# Altium project STM32H743XIH6 SOM Bd.PrjPcb (part 1 of 2)
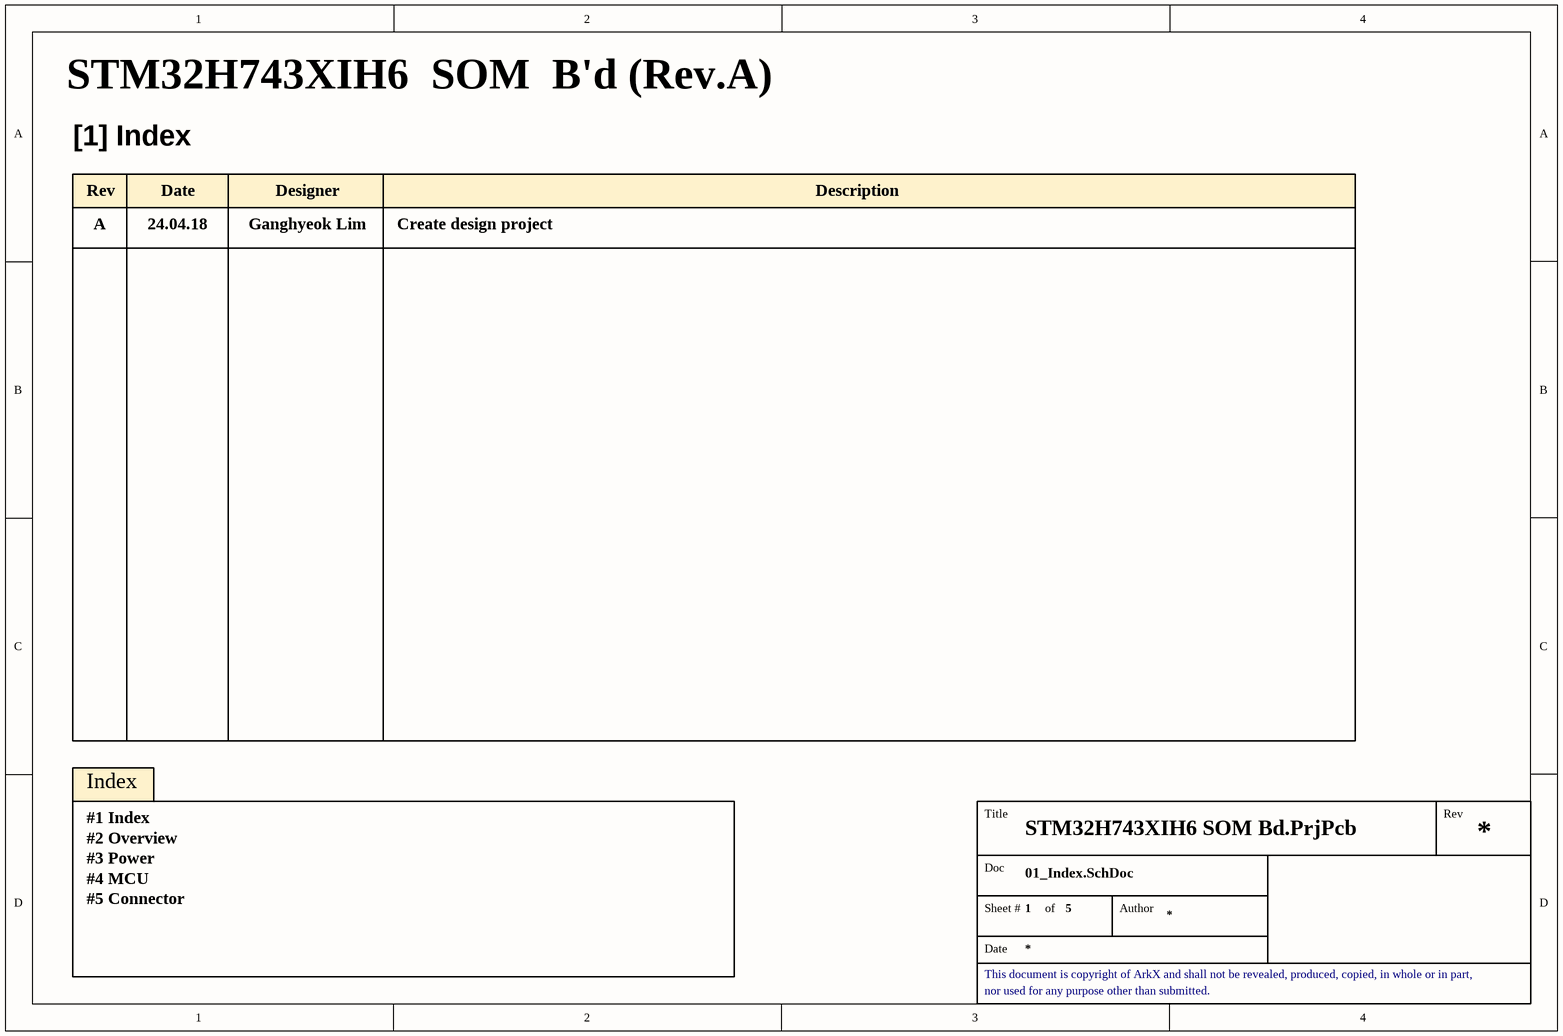
[diagram p0: 01_Index.SchDoc]
7 sheets, 147 parts. Net scope: flat (ports and power ports of the same name join across sheets).
Board file: STM32H743XIH6_SOM_Bd.PcbDoc
Sheets:
  01_Index.SchDoc
  02_Overview.SchDoc
  03_Power.SchDoc
  04_MCU-Part1.SchDoc
  05_MCU-Part2.SchDoc
  06_MCU_Part3.SchDoc
  07_Connector.SchDoc

## Sheet 01_Index.SchDoc
size A4; SheetNumber: 1; SheetTotal: 5

### Notes on the sheet
- STM32H743XIH6  SOM  B'd (Rev.A)
- [1] Index
- Rev
- A
- 24.04.18
- Date
- Ganghyeok Lim
- Designer
- Create design project
- Description
- Index
- #1 Index
- #2 Overview
- #3 Power
- #4 MCU
- #5 Connector
- Title
- Doc
- Sheet #
- of
- Author
- This document is copyright of ArkX and shall not be revealed, produced, copied, in whole or in part,
- nor used for any purpose other than submitted.

## Sheet 02_Overview.SchDoc
size A4; SheetNumber: 2; SheetTotal: 5
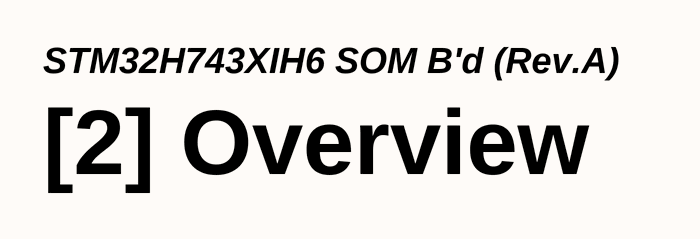
[diagram p1: 02_Overview.SchDoc]

### Notes on the sheet
- STM32H743XIH6 SOM B'd (Rev.A)
- [2] Overview
- Title
- Rev
- Doc
- Sheet #
- of
- Author
- This document is copyright of ArkX and shall not be revealed, produced, copied, in whole or in part,
- Date
- nor used for any purpose other than submitted.

## Sheet 03_Power.SchDoc
size A4; SheetNumber: 3; SheetTotal: 7
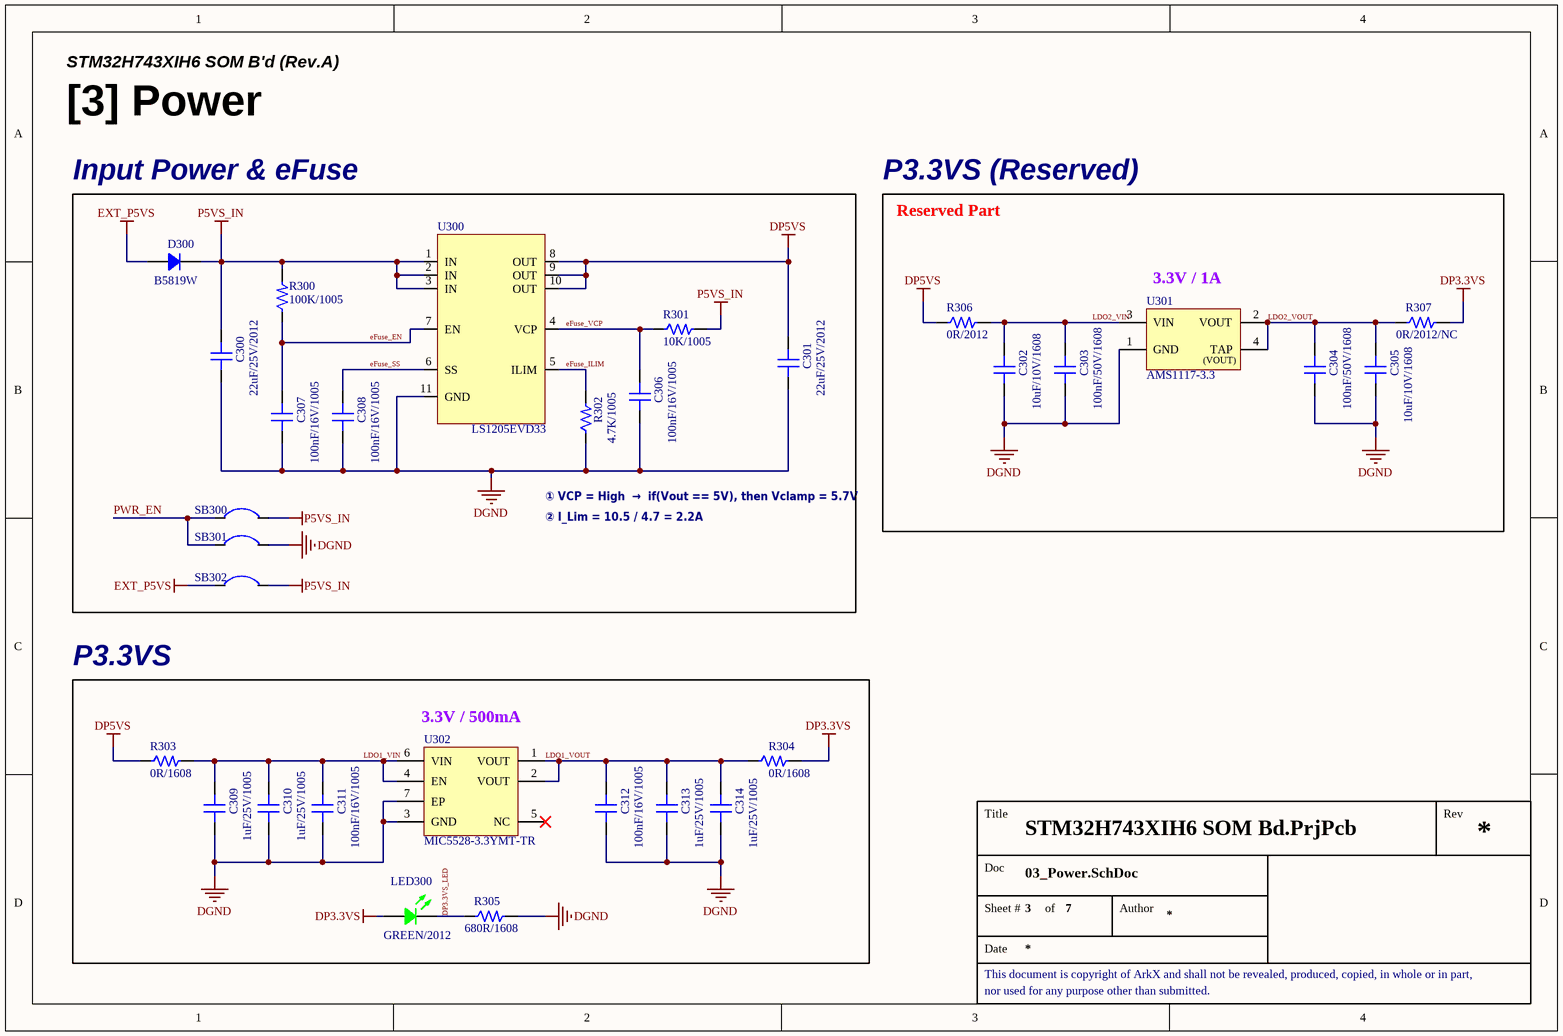
[diagram p2: 03_Power.SchDoc]

### Parts
C300  22uF/25V/2012  [CAP 2012 (0805_INCH)]
C301  22uF/25V/2012  [CAP 2012 (0805_INCH)]
C302  10uF/10V/1608  [CAP 1608 (0603_INCH)]
C303  100nF/50V/1608  [CAP 1608 (0603_INCH)]
C304  100nF/50V/1608  [CAP 1608 (0603_INCH)]
C305  10uF/10V/1608  [CAP 1608 (0603_INCH)]
C306  100nF/16V/1005  [CAP 1005 (0402_INCH)]
C307  100nF/16V/1005  [CAP 1005 (0402_INCH)]
C308  100nF/16V/1005  [CAP 1005 (0402_INCH)]
C309  1uF/25V/1005  [CAP 1005 (0402_INCH)]
C310  1uF/25V/1005  [CAP 1005 (0402_INCH)]
C311  100nF/16V/1005  [CAP 1005 (0402_INCH)]
C312  100nF/16V/1005  [CAP 1005 (0402_INCH)]
C313  1uF/25V/1005  [CAP 1005 (0402_INCH)]
C314  1uF/25V/1005  [CAP 1005 (0402_INCH)]
D300  B5819W  [DIO_SOD-123]
LED300  GREEN/2012  [LED MHT170RGBCT (GREEN)]
R300  100K/1005  [RES 1005 (0402_inch)]
R301  10K/1005  [RES 1005 (0402_inch)]
R302  4.7K/1005  [RES 1005 (0402_inch)]
R303  0R/1608  [RES 1608 (0603_inch)]
R304  0R/1608  [RES 1608 (0603_inch)]
R305  680R/1608  [RES 1608 (0603_inch)]
R306  0R/2012  [RES 2012 (0805_inch)]
R307  0R/2012/NC  [RES 2012 (0805_INCH)/NC]
SB300  SB  [SB (Solder-Bridge)]  (value not drawn)
SB301  SB  [SB (Solder-Bridge)]  (value not drawn)
SB302  SB  [SB (Solder-Bridge)]  (value not drawn)
U300  LS1205EVD33  [IC_DFN_3x3_10L]
U301  AMS1117-3.3  [SOT 223-3 (DIODES INCORPORATED)]
U302  MIC5528-3.3YMT-TR  [IC_TDFN-6]

### Blocks framed on the sheet
Input Power & eFuse: C300 C301 C306-C308 D300 R300-R302 SB300-SB302 U300
P3.3VS (Reserved): C302-C305 R306 R307 U301
P3.3VS: C309-C314 LED300 R303-R305 U302

### Nets
DGND: C300.1 C301.1 C302.1 C303.1 C304.1 C305.1 C306.1 C307.1 C308.1 C309.1 C310.1 C311.1 C312.1 C313.1 C314.1 R302.1 R305.2 SB301.2 U300.11(GND) U301.1(GND) U302.3(GND) U302.7(EP)
DP3.3VS: LED300.4(Common_Anode) R304.2 R307.2
DP5VS: C301.2 R303.1 R306.1 U300.8(OUT) U300.9(OUT) U300.10(OUT)
EXT_P5VS: D300.1 SB302.1
P5VS_IN: C300.2 D300.2 R300.2 R301.2 SB300.2 SB302.2 U300.1(IN) U300.2(IN) U300.3(IN)
DP3.3VS_LED: LED300.2(GREEN) R305.1
eFuse_EN: C307.2 R300.1 U300.7(EN)
eFuse_ILIM: R302.2 U300.5(ILIM)
eFuse_SS: C308.2 U300.6(SS)
eFuse_VCP: C306.2 R301.1 U300.4(VCP)
LDO1_VIN: C309.2 C310.2 C311.2 R303.2 U302.4(EN) U302.6(VIN)
LDO1_VOUT: C312.2 C313.2 C314.2 R304.1 U302.1(VOUT) U302.2(VOUT)
LDO2_VIN: C302.2 C303.2 R306.2 U301.3(VIN)
LDO2_VOUT: C304.2 C305.2 R307.1 U301.2(VOUT) U301.4(TAP)
PWR_EN: SB300.1 SB301.1

Not connected (* = marked no-connect by the designer): U302 5(NC)*

### Notes on the sheet
- STM32H743XIH6 SOM B'd (Rev.A)
- [3] Power
- Reserved Part
- (near U301) 3.3V / 1A
- ① VCP = High  →  if(Vout == 5V), then Vclamp = 5.7V
- ② I_Lim = 10.5 / 4.7 = 2.2A
- (near U302) 3.3V / 500mA
- Title
- Rev
- Doc
- Sheet #
- of
- Author
- This document is copyright of ArkX and shall not be revealed, produced, copied, in whole or in part,
- Date
- nor used for any purpose other than submitted.
- (in symbol IC_REG_AMS1117-3.3) (VOUT)

### Library data of the parts
C300 C301 = CAP_22uF/25V/2012: Ceramic CAP_22uF/25V/2012; LCSC Part #: C45783; JLCPCB Part Type: Basic Part
C302 C305 = CAP_10uF/10V/1608: Ceramic CAP_10uF/10V/1608; LCSC Part #: C19702; JLCPCB Part Type: Basic Part
C303 C304 = CAP_100nF/50V/1608: Ceramic CAP_100nF/50V/1608; LCSC Part #: C14663; JLCPCB Part Type: Basic Part
C306-C308 C311 C312 = CAP_100nF/16V/1005: Ceramic CAP_100nF/16V/1005; LCSC Part #: C1525; JLCPCB Part Type: Basic Part
C309 C310 C313 C314 = CAP_1uF/25V/1005: Ceramic CAP_1uF/25V/1005; LCSC Part #: C52923; JLCPCB Part Type: Basic Part
D300 = DIO_B5819W: 40V 600mV@1A 1A SOD-123  Schottky Barrier Diodes (SBD) ROHS; LCSC Part #: C8598; JLCPCB Part Type: Basic Part
LED300 = LED_MHT170RGBCT(GREEN): Colorless transparence -30℃~+85℃ Positive post Common anode RGB 120° 0805  Light Emitting Diodes (LED) ROHS; LCSC Part #: C2962094; JLCPCB Part Type: Extended Part
R300 = RES_100K/1005/62.5mW: Value: 100K; Power Rating: 62.5mW; Precision: 1%; Size: 1005; LCSC Part #: C25741; JLCPCB Part Type: Basic Part
R301 = RES_10K/1005/62.5mW: Value: 10K; Power Rating: 62.5mW; Precision: 1%; Size: 1005; LCSC Part #: C25744; JLCPCB Part Type: Basic Part
R302 = RES_4.7K/1005/62.5mW: Value: 4.7K; Power Rating: 62.5mW; Precision: 1%; Size: 1005; LCSC Part #: C25900; JLCPCB Part Type: Basic Part
R303 R304 = RES_0R/1608/0.1W: Value: 0R; Power Rating: 0.1W; Precision: 1%; Size: 1608; LCSC Part #: C21189; JLCPCB Part Type: Basic Part
R305 = RES_680R/1608/0.1W: Value: 680R; Power Rating: 0.1W; Precision: 1%; Size: 1608; LCSC Part #: C23228; JLCPCB Part Type: Basic Part
R306 = RES_0R/2012/0.125W: Value: 0R; Power Rating: 0.125W; Precision: 1%; Size: 2012; LCSC Part #: C17477; JLCPCB Part Type: Basic Part
R307 = RES_NC_0R/2012/0.125W: 0R/2012/0.125W/NC; Value: 0R; Power Rating: 0.1W; Precision: 1%; Size: 1608
SB300-SB302 = SB_Solder-Bridge
U300 = IC_eFUSE_LS1205EVD33: 18V, 5A eFuse with Programmable Current Limit and Output Voltage Clamp, 10-DFN (3x3)
U301 = IC_REG_AMS1117-3.3: 72dB@(120Hz) 1A 1.3V@(800mA) Fixed 3.3V~3.3V Positive 1 SOT-223  Linear Voltage Regulators (LDO) ROHS; LCSC Part #: C6186; JLCPCB Part Type: Basic Part
U302 = IC_REG_MIC5528-3.3YMT-TR: Linear Voltage Regulator IC Positive Fixed 1 Output 500mA 6-TDFN (1.2x1.2); LCSC Part #: C622490; JLCPCB Part Type: Extended Part

## Sheet 04_MCU-Part1.SchDoc
size A3; SheetNumber: 4; SheetTotal: 7
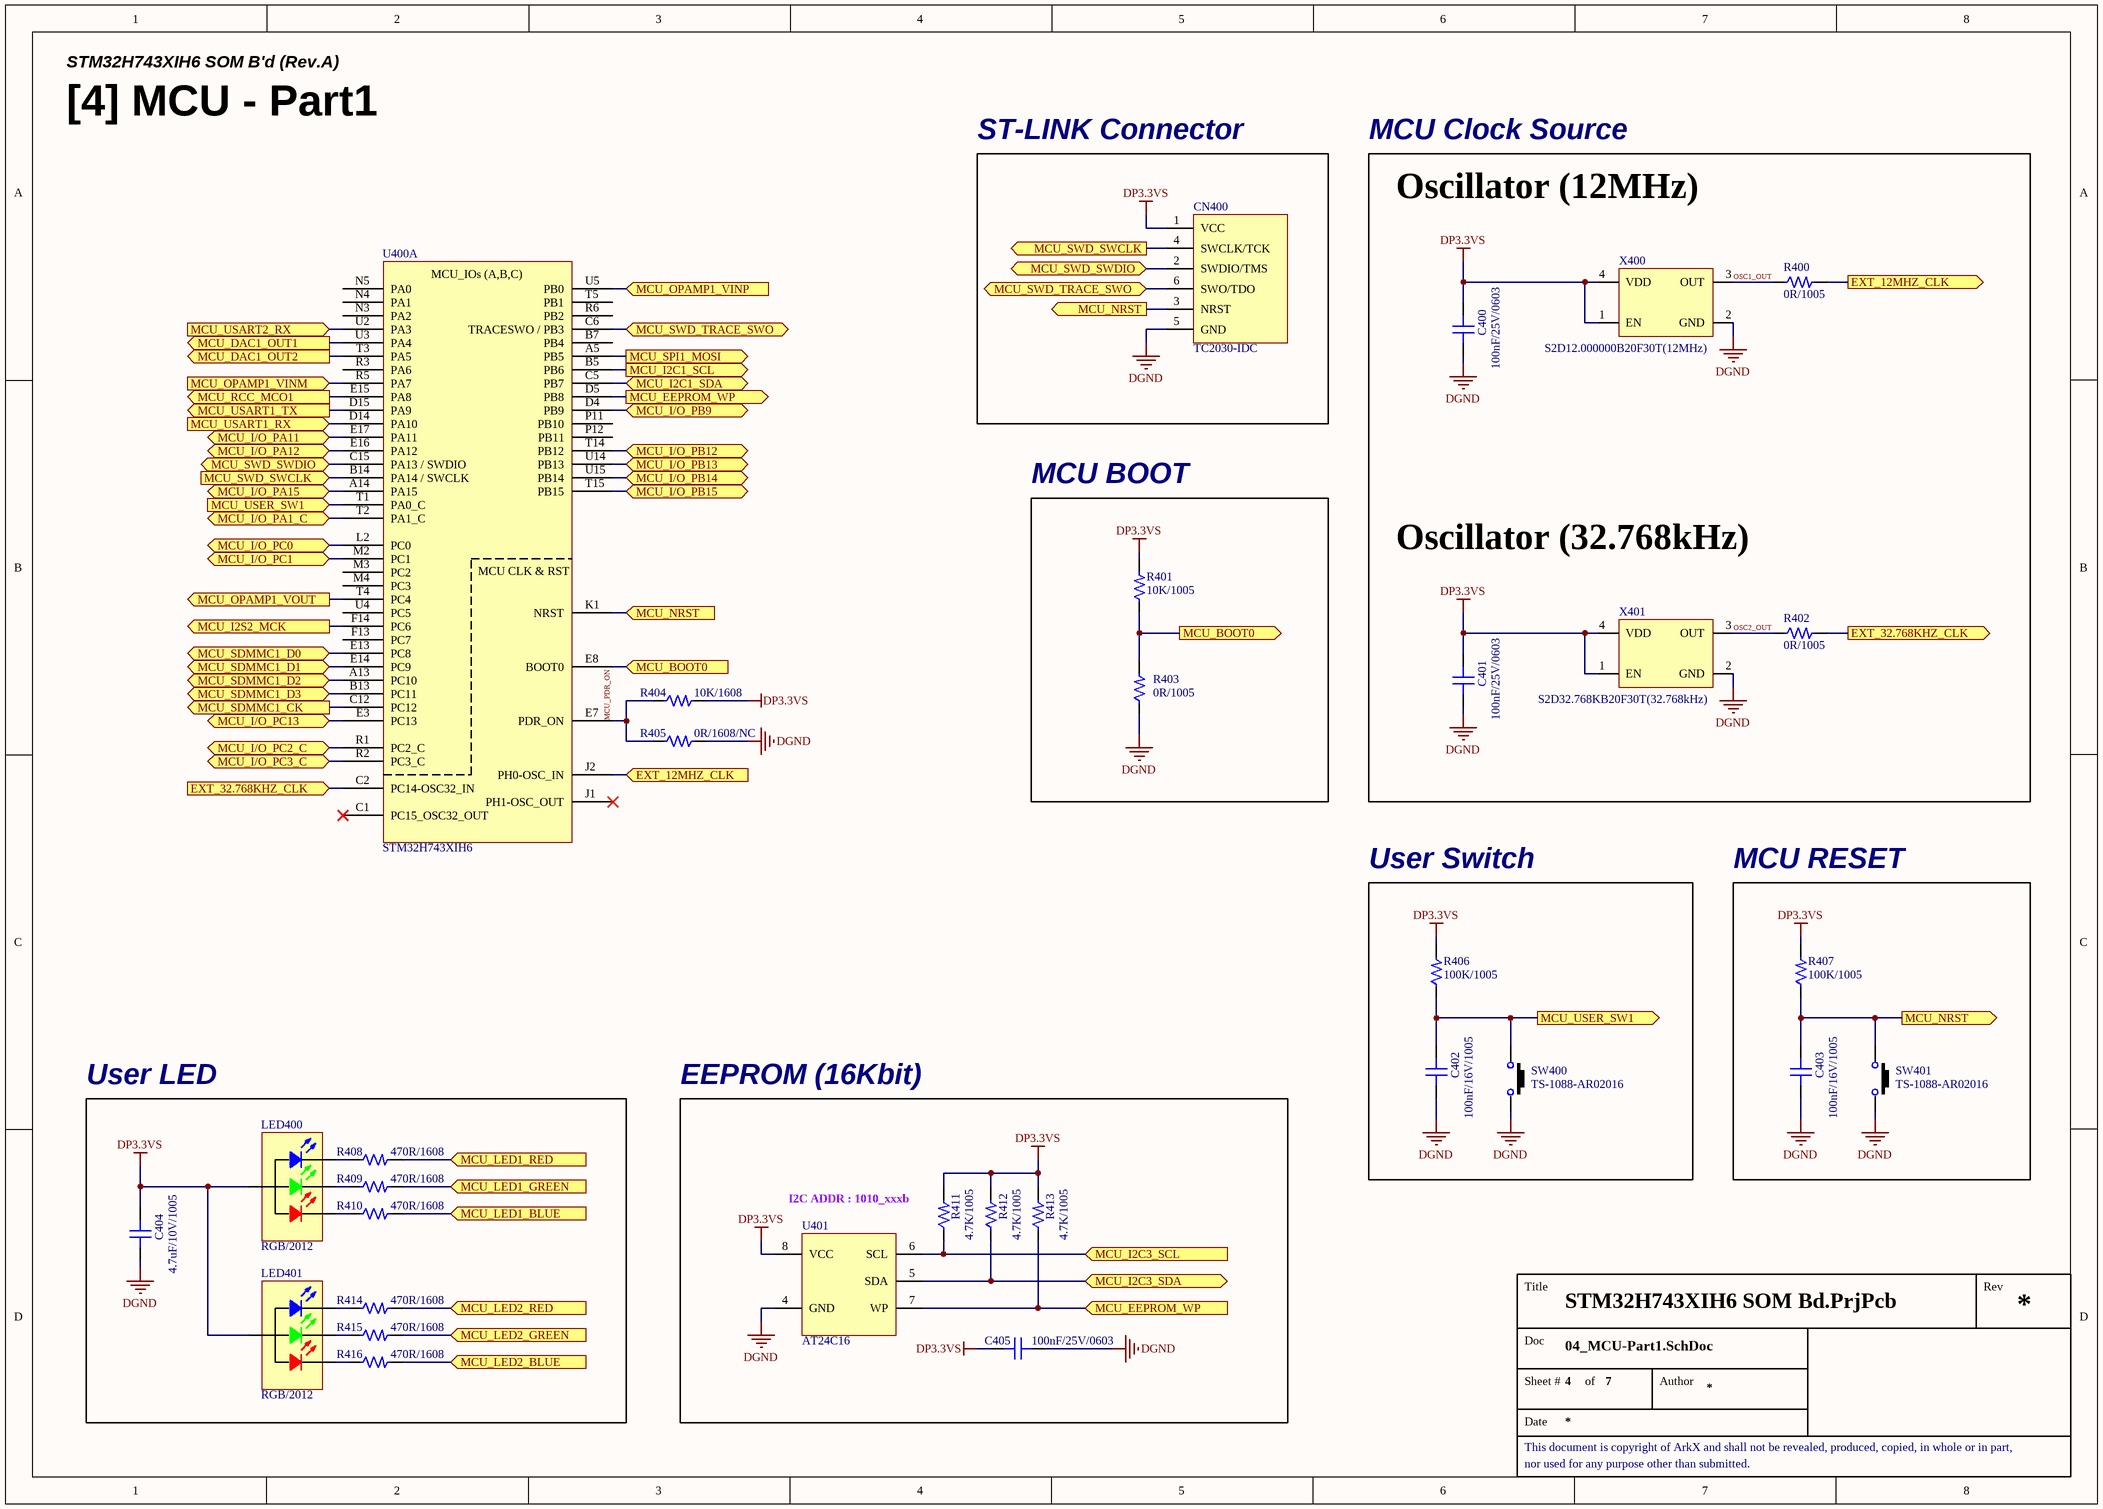
[diagram p3: 04_MCU-Part1.SchDoc]

### Parts
C400  100nF/25V/0603  [CAP 0603 (0201_INCH)]
C401  100nF/25V/0603  [CAP 0603 (0201_INCH)]
C402  100nF/16V/1005  [CAP 1005 (0402_INCH)]
C403  100nF/16V/1005  [CAP 1005 (0402_INCH)]
C404  4.7uF/10V/1005  [CAP 1005 (0402_INCH)]
C405  100nF/25V/0603  [CAP 0603 (0201_INCH)]
CN400  TC2030-IDC  [CON_TC2030-FP]  (no BOM)
LED400  RGB/2012  [LED MHT170RGBCT]
LED401  RGB/2012  [LED MHT170RGBCT]
R400  0R/1005  [RES 1005 (0402_inch)]
R401  10K/1005  [RES 1005 (0402_inch)]
R402  0R/1005  [RES 1005 (0402_inch)]
R403  0R/1005  [RES 1005 (0402_inch)]
R404  10K/1608  [RES 1608 (0603_inch)]
R405  0R/1608/NC  [RES 1608 (0603_inch)/NC]
R406  100K/1005  [RES 1005 (0402_inch)]
R407  100K/1005  [RES 1005 (0402_inch)]
R408  470R/1608  [RES 1608 (0603_inch)]
R409  470R/1608  [RES 1608 (0603_inch)]
R410  470R/1608  [RES 1608 (0603_inch)]
R411  4.7K/1005  [RES 1005 (0402_inch)]
R412  4.7K/1005  [RES 1005 (0402_inch)]
R413  4.7K/1005  [RES 1005 (0402_inch)]
R414  470R/1608  [RES 1608 (0603_inch)]
R415  470R/1608  [RES 1608 (0603_inch)]
R416  470R/1608  [RES 1608 (0603_inch)]
SW400  TS-1088-AR02016  [SW_TS-1088-AR02016]
SW401  TS-1088-AR02016  [SW_TS-1088-AR02016]
U400  STM32H743XIH6  [IC TFBGA-265]  (part A of 4)
U401  AT24C16  [TSSOP-8_PW (TI)]
X400  S2D12.000000B20F30T(12MHz)  [OSC SMD_2.5x2.0 (SCTF)]
X401  S2D32.768KB20F30T(32.768kHz)  [OSC SMD_2.5x2.0 (SCTF)]

### Blocks framed on the sheet
ST-LINK Connector: CN400
MCU BOOT: R401 R403
User Switch: C402 R406 SW400
MCU RESET: C403 R407 SW401
User LED: C404 LED400 LED401 R408-R410 R414-R416
EEPROM (16Kbit): C405 R411-R413 U401

### Ports
EXT_12MHZ_CLK (in), EXT_12MHZ_CLK (out), EXT_32.768KHZ_CLK (in), EXT_32.768KHZ_CLK (out), MCU_BOOT0 (in), MCU_BOOT0 (out), MCU_DAC1_OUT1 (out), MCU_DAC1_OUT2 (out), MCU_EEPROM_WP (in), MCU_EEPROM_WP (out), MCU_I2C1_SCL (out), MCU_I2C1_SDA (bidir), MCU_I2C3_SCL (in), MCU_I2C3_SDA (bidir), MCU_I2S2_MCK (out), MCU_I/O_PA1_C (bidir), MCU_I/O_PA11 (bidir), MCU_I/O_PA12 (bidir), MCU_I/O_PA15 (bidir), MCU_I/O_PB9 (bidir), MCU_I/O_PB12 (bidir), MCU_I/O_PB13 (bidir), MCU_I/O_PB14 (bidir), MCU_I/O_PB15 (bidir), MCU_I/O_PC0 (bidir), MCU_I/O_PC1 (bidir), MCU_I/O_PC2_C (bidir), MCU_I/O_PC3_C (bidir), MCU_I/O_PC13 (bidir), MCU_LED1_BLUE (in), MCU_LED1_GREEN (in), MCU_LED1_RED (in), MCU_LED2_BLUE (in), MCU_LED2_GREEN (in), MCU_LED2_RED (in), MCU_NRST (in), MCU_NRST (out), MCU_OPAMP1_VINM (in), MCU_OPAMP1_VINP (in), MCU_OPAMP1_VOUT (out), MCU_RCC_MCO1 (out), MCU_SDMMC1_CK (out), MCU_SDMMC1_D0 (bidir), MCU_SDMMC1_D1 (bidir), MCU_SDMMC1_D2 (bidir), MCU_SDMMC1_D3 (bidir), MCU_SPI1_MOSI (out), MCU_SWD_SWCLK (in), MCU_SWD_SWCLK (out), MCU_SWD_SWDIO (bidir), MCU_SWD_TRACE_SWO (bidir), MCU_USART1_RX (in), MCU_USART1_TX (out), MCU_USART2_RX (in), MCU_USER_SW1 (in), MCU_USER_SW1 (out)

### Nets
DGND: C400.2 C401.2 C402.1 C403.1 C404.1 C405.2 CN400.5(GND) R403.1 R405.2 SW400.2 SW401.2 U401.4(GND) X400.2(GND) X401.2(GND)
DP3.3VS: C400.1 C401.1 C404.2 C405.1 CN400.1(VCC) LED400.4(Common_Anode) LED401.4(Common_Anode) R401.2 R404.2 R406.2 R407.2 R411.2 R412.2 R413.2 U401.8(VCC) X400.1(EN) X400.4(VDD) X401.1(EN) X401.4(VDD)
EXT_12MHZ_CLK: R400.2 U400.J2(PH0-OSC_IN) ; port EXT_12MHZ_CLK
EXT_32.768KHZ_CLK: R402.2 U400.C2(PC14-OSC32_IN) ; port EXT_32.768KHZ_CLK
MCU_BOOT0: R401.1 R403.2 U400.E8(BOOT0) ; port MCU_BOOT0
MCU_DAC1_OUT1: U400.U3(PA4) ; port MCU_DAC1_OUT1
MCU_DAC1_OUT2: U400.T3(PA5) ; port MCU_DAC1_OUT2
MCU_EEPROM_WP: R413.1 U400.D5(PB8) U401.7(WP) ; port MCU_EEPROM_WP
MCU_I2C1_SCL: U400.B5(PB6) ; port MCU_I2C1_SCL
MCU_I2C1_SDA: U400.C5(PB7) ; port MCU_I2C1_SDA
MCU_I2C3_SCL: R411.1 U401.6(SCL) ; port MCU_I2C3_SCL
MCU_I2C3_SDA: R412.1 U401.5(SDA) ; port MCU_I2C3_SDA
MCU_I2S2_MCK: U400.F14(PC6) ; port MCU_I2S2_MCK
MCU_I/O_PA1_C: U400.T2(PA1_C) ; port MCU_I/O_PA1_C
MCU_I/O_PA11: U400.E17(PA11) ; port MCU_I/O_PA11
MCU_I/O_PA12: U400.E16(PA12) ; port MCU_I/O_PA12
MCU_I/O_PA15: U400.A14(PA15) ; port MCU_I/O_PA15
MCU_I/O_PB9: U400.D4(PB9) ; port MCU_I/O_PB9
MCU_I/O_PB12: U400.T14(PB12) ; port MCU_I/O_PB12
MCU_I/O_PB13: U400.U14(PB13) ; port MCU_I/O_PB13
MCU_I/O_PB14: U400.U15(PB14) ; port MCU_I/O_PB14
MCU_I/O_PB15: U400.T15(PB15) ; port MCU_I/O_PB15
MCU_I/O_PC0: U400.L2(PC0) ; port MCU_I/O_PC0
MCU_I/O_PC1: U400.M2(PC1) ; port MCU_I/O_PC1
MCU_I/O_PC2_C: U400.R1(PC2_C) ; port MCU_I/O_PC2_C
MCU_I/O_PC3_C: U400.R2(PC3_C) ; port MCU_I/O_PC3_C
MCU_I/O_PC13: U400.E3(PC13) ; port MCU_I/O_PC13
MCU_LED1_BLUE: R410.2 ; port MCU_LED1_BLUE
MCU_LED1_GREEN: R409.2 ; port MCU_LED1_GREEN
MCU_LED1_RED: R408.2 ; port MCU_LED1_RED
MCU_LED2_BLUE: R416.2 ; port MCU_LED2_BLUE
MCU_LED2_GREEN: R415.2 ; port MCU_LED2_GREEN
MCU_LED2_RED: R414.2 ; port MCU_LED2_RED
MCU_NRST: C403.2 CN400.3(NRST) R407.1 SW401.1 U400.K1(NRST) ; port MCU_NRST
MCU_OPAMP1_VINM: U400.R5(PA7) ; port MCU_OPAMP1_VINM
MCU_OPAMP1_VINP: U400.U5(PB0) ; port MCU_OPAMP1_VINP
MCU_OPAMP1_VOUT: U400.T4(PC4) ; port MCU_OPAMP1_VOUT
MCU_PDR_ON: R404.1 R405.1 U400.E7(PDR_ON)
MCU_RCC_MCO1: U400.E15(PA8) ; port MCU_RCC_MCO1
MCU_SDMMC1_CK: U400.C12(PC12) ; port MCU_SDMMC1_CK
MCU_SDMMC1_D0: U400.E13(PC8) ; port MCU_SDMMC1_D0
MCU_SDMMC1_D1: U400.E14(PC9) ; port MCU_SDMMC1_D1
MCU_SDMMC1_D2: U400.A13(PC10) ; port MCU_SDMMC1_D2
MCU_SDMMC1_D3: U400.B13(PC11) ; port MCU_SDMMC1_D3
MCU_SPI1_MOSI: U400.A5(PB5) ; port MCU_SPI1_MOSI
MCU_SWD_SWCLK: CN400.4(SWCLK/TCK) U400.B14(PA14_/_SWCLK) ; port MCU_SWD_SWCLK
MCU_SWD_SWDIO: CN400.2(SWDIO/TMS) U400.C15(PA13_/_SWDIO) ; port MCU_SWD_SWDIO
MCU_SWD_TRACE_SWO: CN400.6(SWO/TDO) U400.C6(TRACESWO_/_PB3) ; port MCU_SWD_TRACE_SWO
MCU_USART1_RX: U400.D14(PA10) ; port MCU_USART1_RX
MCU_USART1_TX: U400.D15(PA9) ; port MCU_USART1_TX
MCU_USART2_RX: U400.U2(PA3) ; port MCU_USART2_RX
MCU_USER_SW1: C402.2 R406.1 SW400.1 U400.T1(PA0_C) ; port MCU_USER_SW1
OSC1_OUT: R400.1 X400.3(OUT)
OSC2_OUT: R402.1 X401.3(OUT)
NetLED400_1: LED400.1(RED) R410.1
NetLED400_2: LED400.2(GREEN) R409.1
NetLED400_3: LED400.3(BLUE) R408.1
NetLED401_1: LED401.1(RED) R416.1
NetLED401_2: LED401.2(GREEN) R415.1
NetLED401_3: LED401.3(BLUE) R414.1

Not connected (* = marked no-connect by the designer): U400 B7(PB4) C1(PC15_OSC32_OUT)* F13(PC7) J1(PH1-OSC_OUT)* M3(PC2) M4(PC3) N3(PA2) N4(PA1) N5(PA0) P11(PB10) P12(PB11) R3(PA6) R6(PB2) T5(PB1) U4(PC5)

### Notes on the sheet
- STM32H743XIH6 SOM B'd (Rev.A)
- [4] MCU - Part1
- MCU Clock Source
- Oscillator (12MHz)
- Oscillator (32.768kHz)
- I2C ADDR : 1010_xxxb
- Title
- Rev
- Doc
- Sheet #
- of
- Author
- This document is copyright of ArkX and shall not be revealed, produced, copied, in whole or in part,
- Date
- nor used for any purpose other than submitted.
- (in symbol IC_MCU_STM32H743XIH6, part A) MCU_IOs (A,B,C); MCU CLK & RST

### Library data of the parts
C400 C401 C405 = CAP_100nF/25V/0603: Ceramic CAP_100nF/25V/0603; JLCPCB Part Type: Extended Part; LCSC Part #: C181047
C402 C403 = CAP_100nF/16V/1005: Ceramic CAP_100nF/16V/1005; LCSC Part #: C1525; JLCPCB Part Type: Basic Part
C404 = CAP_4.7uF/10V/1005: 10V 4.7uF X5R ±20% 0402  Multilayer Ceramic Capacitors MLCC - SMD/SMT ROHS; JLCPCB Part Type: Basic Part; LCSC Part #: C23733
CN400 = CON_TC2030-IDC: Tag-Connect No-Solder SWD Debug Connector DO NOT PLACE; Manufacturer Part Number: TC2030; Manufacturer: Tag-Connect
LED400 LED401 = LED_RGB_MHT170RGBCT: Colorless transparence -30℃~+85℃ Positive post Common anode RGB 120° 0805  Light Emitting Diodes (LED) ROHS; LCSC Part #: C2962094; JLCPCB Part Type: Extended Part
R400 R402 R403 = RES_0R/1005/62.5mW: Value: 0R; Power Rating: 62.5mW; Precision: 1%; Size: 1005; LCSC Part #: C17168; JLCPCB Part Type: Basic Part
R401 = RES_10K/1005/62.5mW: as R301 on sheet 03_Power; Size: 1005; LCSC Part #: C25744; JLCPCB Part Type: Basic Part
R404 = RES_10K/1608/0.1W: Value: 10K; Power Rating: 0.1W; Precision: 1%; Size: 1608; LCSC Part #: C25804; JLCPCB Part Type: Basic Part
R405 = RES_NC_0R/1608/0.1W: 0R/1608/0.1W/NC; Value: 0R; Power Rating: 0.1W; Precision: 1%; Size: 1608
R406 R407 = RES_100K/1005/62.5mW: as R300 on sheet 03_Power; Size: 1005; LCSC Part #: C25741; JLCPCB Part Type: Basic Part
R408-R410 R414-R416 = RES_470R/1608/0.1W: Value: 470R; Power Rating: 0.1W; Precision: 1%; Size: 1608; LCSC Part #: C23179; JLCPCB Part Type: Basic Part
R411-R413 = RES_4.7K/1005/62.5mW: as R302 on sheet 03_Power; Size: 1005; LCSC Part #: C25900; JLCPCB Part Type: Basic Part
SW400 SW401 = SW_TS-1088-AR02016: NO 50mA 100MΩ 100000 Times 12V 160gf@±50gf Brick nogging SPST SMD  Tactile Switches ROHS; LCSC Part #: C720477; JLCPCB Part Type: Extended Part
U400 = IC_MCU_STM32H743XIH6: ARM® Cortex®-M7 STM32H7 MCU IC 32bit Single-core 480MHz 2MB(2M x 8) Flash 240+25-TFBGA(14x14); LCSC Part #: C114407; JLCPCB Part Type: Extended Part
U401 = IC_EEPROM_AT24C16: IC EEPROM 16KBIT I2C 1MHZ 8TSSOP; LCSC Part #: C112954; JLCPCB Part Type: Extended Part
X400 = OSC_S2D12.000000B20F30T(12MHz): 3.3V~3.3V -40℃~+85℃ 20mA ±20ppm 12MHz SMD2520-4P  Oscillators ROHS; LCSC Part #: C387449; JLCPCB Part Type: Extended Part
X401 = OSC_S2D32.768KB20F30T(32.768kHz): 3.3V ±20ppm CMOS 32.768kHz SMD2520-4P  Oscillators ROHS; LCSC Part #: C387463; JLCPCB Part Type: Extended Part

## Sheet 05_MCU-Part2.SchDoc
size A3; SheetNumber: 5; SheetTotal: 7
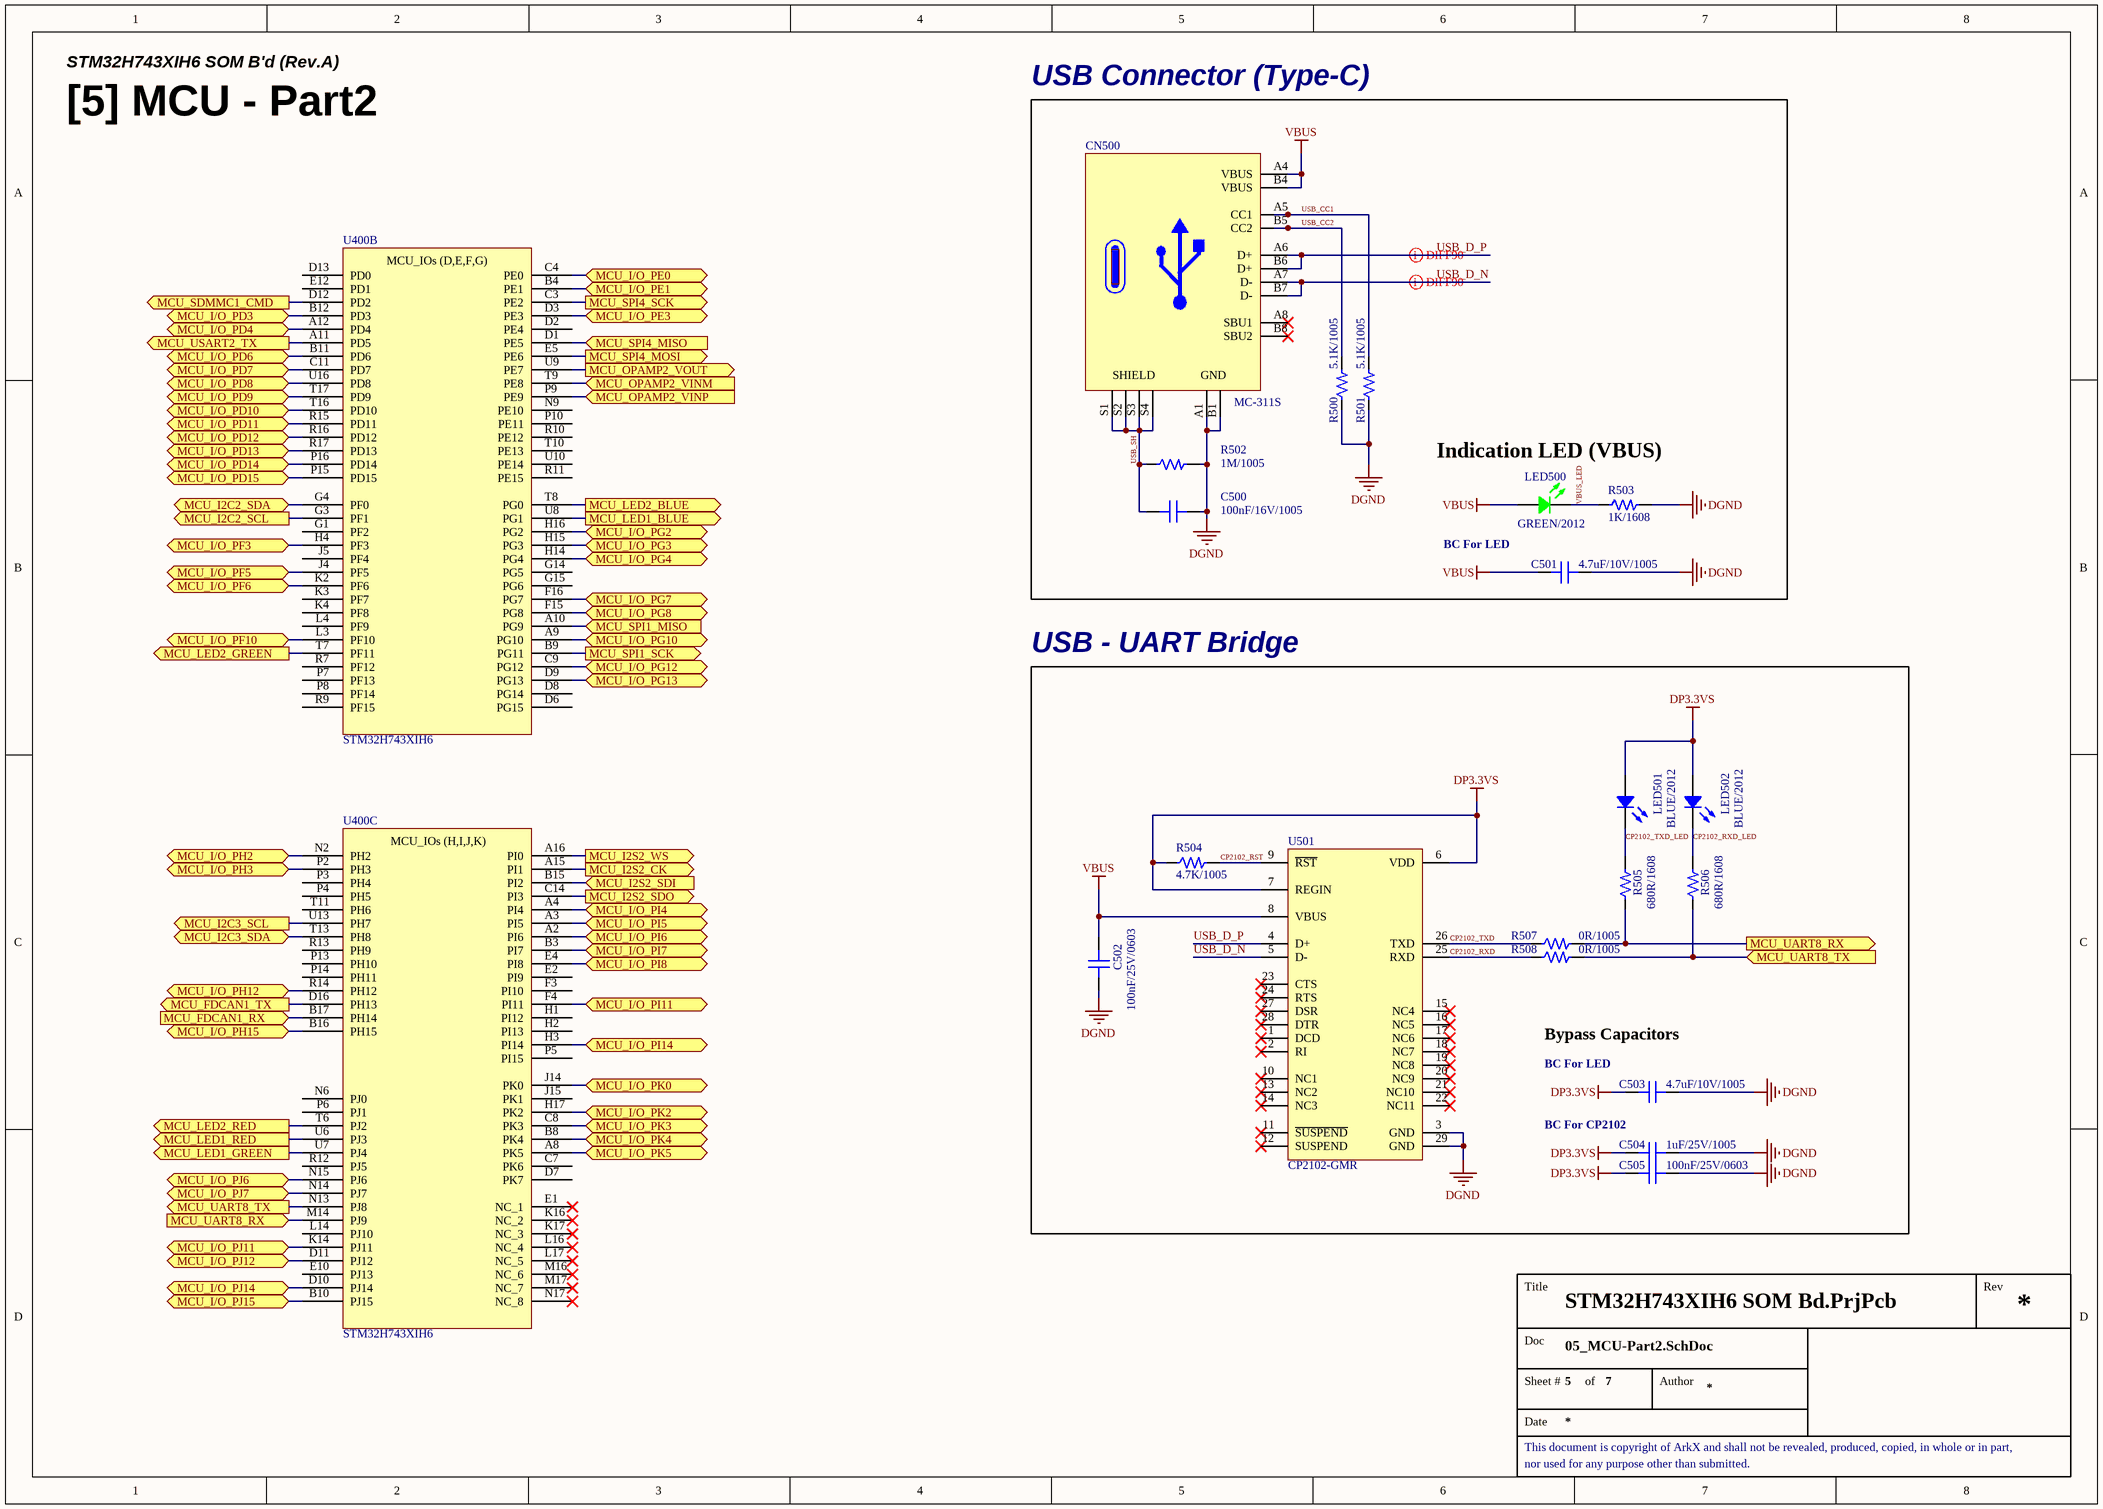
[diagram p4: 05_MCU-Part2.SchDoc]

### Parts
C500  100nF/16V/1005  [CAP 1005 (0402_INCH)]
C501  4.7uF/10V/1005  [CAP 1005 (0402_INCH)]
C502  100nF/25V/0603  [CAP 0603 (0201_INCH)]
C503  4.7uF/10V/1005  [CAP 1005 (0402_INCH)]
C504  1uF/25V/1005  [CAP 1005 (0402_INCH)]
C505  100nF/25V/0603  [CAP 0603 (0201_INCH)]
CN500  MC-311S  [CON USB-Type-C (16P)]
LED500  GREEN/2012  [LED MHT170RGBCT (GREEN)]
LED501  BLUE/2012  [LED MHT170RGBCT (BLUE)]
LED502  BLUE/2012  [LED MHT170RGBCT (BLUE)]
R500  5.1K/1005  [RES 1005 (0402_inch)]
R501  5.1K/1005  [RES 1005 (0402_inch)]
R502  1M/1005  [RES 1005 (0402_inch)]
R503  1K/1608  [RES 1608 (0603_inch)]
R504  4.7K/1005  [RES 1005 (0402_inch)]
R505  680R/1608  [RES 1608 (0603_inch)]
R506  680R/1608  [RES 1608 (0603_inch)]
R507  0R/1005  [RES 1005 (0402_inch)]
R508  0R/1005  [RES 1005 (0402_inch)]
U400  STM32H743XIH6  [IC TFBGA-265]  (parts B,C of 4)
U501  CP2102-GMR  [QFN-28 (5x5mm)]

### Blocks framed on the sheet
USB Connector (Type-C): C500 C501 CN500 LED500 R500-R503
USB - UART Bridge: C502-C505 LED501 LED502 R504-R508 U501

### Ports
MCU_FDCAN1_RX (in), MCU_FDCAN1_TX (out), MCU_I2C2_SCL (out), MCU_I2C2_SDA (bidir), MCU_I2C3_SCL (out), MCU_I2C3_SDA (bidir), MCU_I2S2_CK (out), MCU_I2S2_SDI (in), MCU_I2S2_SDO (out), MCU_I2S2_WS (out), MCU_I/O_PD3 (bidir), MCU_I/O_PD4 (bidir), MCU_I/O_PD6 (bidir), MCU_I/O_PD7 (bidir), MCU_I/O_PD8 (bidir), MCU_I/O_PD9 (bidir), MCU_I/O_PD10 (bidir), MCU_I/O_PD11 (bidir), MCU_I/O_PD12 (bidir), MCU_I/O_PD13 (bidir), MCU_I/O_PD14 (bidir), MCU_I/O_PD15 (bidir), MCU_I/O_PE0 (bidir), MCU_I/O_PE1 (bidir), MCU_I/O_PE3 (bidir), MCU_I/O_PF3 (bidir), MCU_I/O_PF5 (bidir), MCU_I/O_PF6 (bidir), MCU_I/O_PF10 (bidir), MCU_I/O_PG2 (bidir), MCU_I/O_PG3 (bidir), MCU_I/O_PG4 (bidir), MCU_I/O_PG7 (bidir), MCU_I/O_PG8 (bidir), MCU_I/O_PG10 (bidir), MCU_I/O_PG12 (bidir), MCU_I/O_PG13 (bidir), MCU_I/O_PH2 (bidir), MCU_I/O_PH3 (bidir), MCU_I/O_PH12 (bidir), MCU_I/O_PH15 (bidir), MCU_I/O_PI4 (bidir), MCU_I/O_PI5 (bidir), MCU_I/O_PI6 (bidir), MCU_I/O_PI7 (bidir), MCU_I/O_PI8 (bidir), MCU_I/O_PI11 (bidir), MCU_I/O_PI14 (bidir), MCU_I/O_PJ6 (bidir), MCU_I/O_PJ7 (bidir), MCU_I/O_PJ11 (bidir), MCU_I/O_PJ12 (bidir), MCU_I/O_PJ14 (bidir), MCU_I/O_PJ15 (bidir), MCU_I/O_PK0 (bidir), MCU_I/O_PK2 (bidir), MCU_I/O_PK3 (bidir), MCU_I/O_PK4 (bidir), MCU_I/O_PK5 (bidir), MCU_LED1_BLUE (out), MCU_LED1_GREEN (out), MCU_LED1_RED (out), MCU_LED2_BLUE (out), MCU_LED2_GREEN (out), MCU_LED2_RED (out), MCU_OPAMP2_VINM (in), MCU_OPAMP2_VINP (in), MCU_OPAMP2_VOUT (out), MCU_SDMMC1_CMD (out), MCU_SPI1_MISO (in), MCU_SPI1_SCK (out), MCU_SPI4_MISO (in), MCU_SPI4_MOSI (out), MCU_SPI4_SCK (out), MCU_UART8_RX (in), MCU_UART8_RX (out), MCU_UART8_TX (in), MCU_UART8_TX (out), MCU_USART2_TX (out)

### Nets
DGND: C500.1 C501.1 C502.2 C503.1 C504.2 C505.1 CN500.A1(GND) CN500.B1(GND) R500.1 R501.1 R502.2 R503.2 U501.3(GND) U501.29(GND)
DP3.3VS: C503.2 C504.1 C505.2 LED501.4(Common_Anode) LED502.4(Common_Anode) R504.1 U501.6(VDD) U501.7(REGIN)
VBUS: C501.2 C502.1 CN500.A4(VBUS) CN500.B4(VBUS) LED500.4(Common_Anode) U501.8(VBUS)
CP2102_RST: R504.2 U501.9(~{RST})
CP2102_RXD: R508.1 U501.25(RXD)
CP2102_RXD_LED: LED502.3(BLUE) R506.2
CP2102_TXD: R507.1 U501.26(TXD)
CP2102_TXD_LED: LED501.3(BLUE) R505.2
MCU_FDCAN1_RX: U400.B17(PH14) ; port MCU_FDCAN1_RX
MCU_FDCAN1_TX: U400.D16(PH13) ; port MCU_FDCAN1_TX
MCU_I2C2_SCL: U400.G3(PF1) ; port MCU_I2C2_SCL
MCU_I2C2_SDA: U400.G4(PF0) ; port MCU_I2C2_SDA
MCU_I2C3_SCL: U400.U13(PH7) ; port MCU_I2C3_SCL
MCU_I2C3_SDA: U400.T13(PH8) ; port MCU_I2C3_SDA
MCU_I2S2_CK: U400.A15(PI1) ; port MCU_I2S2_CK
MCU_I2S2_SDI: U400.B15(PI2) ; port MCU_I2S2_SDI
MCU_I2S2_SDO: U400.C14(PI3) ; port MCU_I2S2_SDO
MCU_I2S2_WS: U400.A16(PI0) ; port MCU_I2S2_WS
MCU_I/O_PD3: U400.B12(PD3) ; port MCU_I/O_PD3
MCU_I/O_PD4: U400.A12(PD4) ; port MCU_I/O_PD4
MCU_I/O_PD6: U400.B11(PD6) ; port MCU_I/O_PD6
MCU_I/O_PD7: U400.C11(PD7) ; port MCU_I/O_PD7
MCU_I/O_PD8: U400.U16(PD8) ; port MCU_I/O_PD8
MCU_I/O_PD9: U400.T17(PD9) ; port MCU_I/O_PD9
MCU_I/O_PD10: U400.T16(PD10) ; port MCU_I/O_PD10
MCU_I/O_PD11: U400.R15(PD11) ; port MCU_I/O_PD11
MCU_I/O_PD12: U400.R16(PD12) ; port MCU_I/O_PD12
MCU_I/O_PD13: U400.R17(PD13) ; port MCU_I/O_PD13
MCU_I/O_PD14: U400.P16(PD14) ; port MCU_I/O_PD14
MCU_I/O_PD15: U400.P15(PD15) ; port MCU_I/O_PD15
MCU_I/O_PE0: U400.C4(PE0) ; port MCU_I/O_PE0
MCU_I/O_PE1: U400.B4(PE1) ; port MCU_I/O_PE1
MCU_I/O_PE3: U400.D3(PE3) ; port MCU_I/O_PE3
MCU_I/O_PF3: U400.H4(PF3) ; port MCU_I/O_PF3
MCU_I/O_PF5: U400.J4(PF5) ; port MCU_I/O_PF5
MCU_I/O_PF6: U400.K2(PF6) ; port MCU_I/O_PF6
MCU_I/O_PF10: U400.L3(PF10) ; port MCU_I/O_PF10
MCU_I/O_PG2: U400.H16(PG2) ; port MCU_I/O_PG2
MCU_I/O_PG3: U400.H15(PG3) ; port MCU_I/O_PG3
MCU_I/O_PG4: U400.H14(PG4) ; port MCU_I/O_PG4
MCU_I/O_PG7: U400.F16(PG7) ; port MCU_I/O_PG7
MCU_I/O_PG8: U400.F15(PG8) ; port MCU_I/O_PG8
MCU_I/O_PG10: U400.A9(PG10) ; port MCU_I/O_PG10
MCU_I/O_PG12: U400.C9(PG12) ; port MCU_I/O_PG12
MCU_I/O_PG13: U400.D9(PG13) ; port MCU_I/O_PG13
MCU_I/O_PH2: U400.N2(PH2) ; port MCU_I/O_PH2
MCU_I/O_PH3: U400.P2(PH3) ; port MCU_I/O_PH3
MCU_I/O_PH12: U400.R14(PH12) ; port MCU_I/O_PH12
MCU_I/O_PH15: U400.B16(PH15) ; port MCU_I/O_PH15
MCU_I/O_PI4: U400.A4(PI4) ; port MCU_I/O_PI4
MCU_I/O_PI5: U400.A3(PI5) ; port MCU_I/O_PI5
MCU_I/O_PI6: U400.A2(PI6) ; port MCU_I/O_PI6
MCU_I/O_PI7: U400.B3(PI7) ; port MCU_I/O_PI7
MCU_I/O_PI8: U400.E4(PI8) ; port MCU_I/O_PI8
MCU_I/O_PI11: U400.F4(PI11) ; port MCU_I/O_PI11
MCU_I/O_PI14: U400.H3(PI14) ; port MCU_I/O_PI14
MCU_I/O_PJ6: U400.N15(PJ6) ; port MCU_I/O_PJ6
MCU_I/O_PJ7: U400.N14(PJ7) ; port MCU_I/O_PJ7
MCU_I/O_PJ11: U400.K14(PJ11) ; port MCU_I/O_PJ11
MCU_I/O_PJ12: U400.D11(PJ12) ; port MCU_I/O_PJ12
MCU_I/O_PJ14: U400.D10(PJ14) ; port MCU_I/O_PJ14
MCU_I/O_PJ15: U400.B10(PJ15) ; port MCU_I/O_PJ15
MCU_I/O_PK0: U400.J14(PK0) ; port MCU_I/O_PK0
MCU_I/O_PK2: U400.H17(PK2) ; port MCU_I/O_PK2
MCU_I/O_PK3: U400.C8(PK3) ; port MCU_I/O_PK3
MCU_I/O_PK4: U400.B8(PK4) ; port MCU_I/O_PK4
MCU_I/O_PK5: U400.A8(PK5) ; port MCU_I/O_PK5
MCU_LED1_BLUE: U400.U8(PG1) ; port MCU_LED1_BLUE
MCU_LED1_GREEN: U400.U7(PJ4) ; port MCU_LED1_GREEN
MCU_LED1_RED: U400.U6(PJ3) ; port MCU_LED1_RED
MCU_LED2_BLUE: U400.T8(PG0) ; port MCU_LED2_BLUE
MCU_LED2_GREEN: U400.T7(PF11) ; port MCU_LED2_GREEN
MCU_LED2_RED: U400.T6(PJ2) ; port MCU_LED2_RED
MCU_OPAMP2_VINM: U400.T9(PE8) ; port MCU_OPAMP2_VINM
MCU_OPAMP2_VINP: U400.P9(PE9) ; port MCU_OPAMP2_VINP
MCU_OPAMP2_VOUT: U400.U9(PE7) ; port MCU_OPAMP2_VOUT
MCU_SDMMC1_CMD: U400.D12(PD2) ; port MCU_SDMMC1_CMD
MCU_SPI1_MISO: U400.A10(PG9) ; port MCU_SPI1_MISO
MCU_SPI1_SCK: U400.B9(PG11) ; port MCU_SPI1_SCK
MCU_SPI4_MISO: U400.D1(PE5) ; port MCU_SPI4_MISO
MCU_SPI4_MOSI: U400.E5(PE6) ; port MCU_SPI4_MOSI
MCU_SPI4_SCK: U400.C3(PE2) ; port MCU_SPI4_SCK
MCU_UART8_RX: R505.1 R507.2 U400.M14(PJ9) ; port MCU_UART8_RX
MCU_UART8_TX: R506.1 R508.2 U400.N13(PJ8) ; port MCU_UART8_TX
MCU_USART2_TX: U400.A11(PD5) ; port MCU_USART2_TX
USB_CC1: CN500.A5(CC1) R501.2
USB_CC2: CN500.B5(CC2) R500.2
USB_D_N: CN500.A7(D-) CN500.B7(D-) U501.5(D-)
USB_D_P: CN500.A6(D+) CN500.B6(D+) U501.4(D+)
USB_SH: C500.2 CN500.S1(SHIELD) CN500.S2(SHIELD) CN500.S3(SHIELD) CN500.S4(SHIELD) R502.1
VBUS_LED: LED500.2(GREEN) R503.1

Not connected (* = marked no-connect by the designer): CN500 A8(SBU1)* B8(SBU2)*; U400 C7(PK6) D2(PE4) D6(PG15) D7(PK7) D8(PG14) D13(PD0) E1(NC_1)* E2(PI9) E10(PJ13) E12(PD1) F3(PI10) G1(PF2) G14(PG5) G15(PG6) H1(PI12) H2(PI13) J5(PF4) J15(PK1) K3(PF7) K4(PF8) K16(NC_2)* K17(NC_3)* L4(PF9) L14(PJ10) L16(NC_4)* L17(NC_5)* M16(NC_6)* M17(NC_7)* N6(PJ0) N9(PE10) N17(NC_8)* P3(PH4) P4(PH5) P5(PI15) P6(PJ1) P7(PF13) P8(PF14) P10(PE11) P13(PH10) P14(PH11) R7(PF12) R9(PF15) R10(PE12) R11(PE15) R12(PJ5) R13(PH9) T10(PE13) T11(PH6) U10(PE14); U501 1(DCD)* 2(RI)* 10(NC1)* 11(~{SUSPEND})* 12(SUSPEND)* 13(NC2)* 14(NC3)* 15(NC4)* 16(NC5)* 17(NC6)* 18(NC7)* 19(NC8)* 20(NC9)* 21(NC10)* 22(NC11)* 23(CTS)* 24(RTS)* 27(DSR)* 28(DTR)*

### Layout directives
differential pair; differential pair class DIFF90: USB_D_N, USB_D_P

### Notes on the sheet
- STM32H743XIH6 SOM B'd (Rev.A)
- [5] MCU - Part2
- Indication LED (VBUS)
- BC For LED
- Bypass Capacitors
- (near C503) BC For LED
- BC For CP2102
- Title
- Rev
- Doc
- Sheet #
- of
- Author
- This document is copyright of ArkX and shall not be revealed, produced, copied, in whole or in part,
- Date
- nor used for any purpose other than submitted.
- (in symbol IC_MCU_STM32H743XIH6, part B) MCU_IOs (D,E,F,G)
- (in symbol IC_MCU_STM32H743XIH6, part C) MCU_IOs (H,I,J,K)

### Library data of the parts
C500 = CAP_100nF/16V/1005: Ceramic CAP_100nF/16V/1005; LCSC Part #: C1525; JLCPCB Part Type: Basic Part
C501 C503 = CAP_4.7uF/10V/1005: as C404 on sheet 04_MCU-Part1; JLCPCB Part Type: Basic Part; LCSC Part #: C23733
C502 C505 = CAP_100nF/25V/0603: Ceramic CAP_100nF/25V/0603; JLCPCB Part Type: Extended Part; LCSC Part #: C181047
C504 = CAP_1uF/25V/1005: Ceramic CAP_1uF/25V/1005; LCSC Part #: C52923; JLCPCB Part Type: Basic Part
CN500 = CON_USB-Type-C: USB 2.0 5A 1 Surface Mount 16 Female -35℃~+75℃ Type-C SMD  USB Connectors ROHS; LCSC Part #: C2977718; JLCPCB Part Type: Extended Part
LED500 = LED_MHT170RGBCT(GREEN): as LED300 on sheet 03_Power; LCSC Part #: C2962094; JLCPCB Part Type: Extended Part
LED501 LED502 = LED_MHT170RGBCT(BLUE): Colorless transparence -30℃~+85℃ Positive post Common anode RGB 120° 0805  Light Emitting Diodes (LED) ROHS; LCSC Part #: C2962094; JLCPCB Part Type: Extended Part
R500 R501 = RES_5.1K/1005/62.5mW: Value: 5.1K; Power Rating: 62.5mW; Precision: 1%; Size: 1005; LCSC Part #: C25905; JLCPCB Part Type: Basic Part
R502 = RES_1M/1005/62.5mW: Value: 1M; Power Rating: 62.5mW; Precision: 1%; Size: 1005; LCSC Part #: C26083; JLCPCB Part Type: Basic Part
R503 = RES_1K/1608/0.1W: Value: 1K; Power Rating: 0.1W; Precision: 1%; Size: 1608; LCSC Part #: C21190; JLCPCB Part Type: Basic Part
R504 = RES_4.7K/1005/62.5mW: as R302 on sheet 03_Power; Size: 1005; LCSC Part #: C25900; JLCPCB Part Type: Basic Part
R505 R506 = RES_680R/1608/0.1W: as R305 on sheet 03_Power; Size: 1608; LCSC Part #: C23228; JLCPCB Part Type: Basic Part
R507 R508 = RES_0R/1005/62.5mW: as R400 on sheet 04_MCU-Part1; Size: 1005; LCSC Part #: C17168; JLCPCB Part Type: Basic Part
U400 = IC_MCU_STM32H743XIH6: as U400 on sheet 04_MCU-Part1; LCSC Part #: C114407; JLCPCB Part Type: Extended Part
U501 = IC_USB_CP2102: Transceiver 1Mbps USB 1/1 QFN-28_5x5x05P  USB ICs ROHS; LCSC Part #: C6568; JLCPCB Part Type: Basic Part

## Sheet 06_MCU_Part3.SchDoc
size A3; SheetNumber: 6; SheetTotal: 7
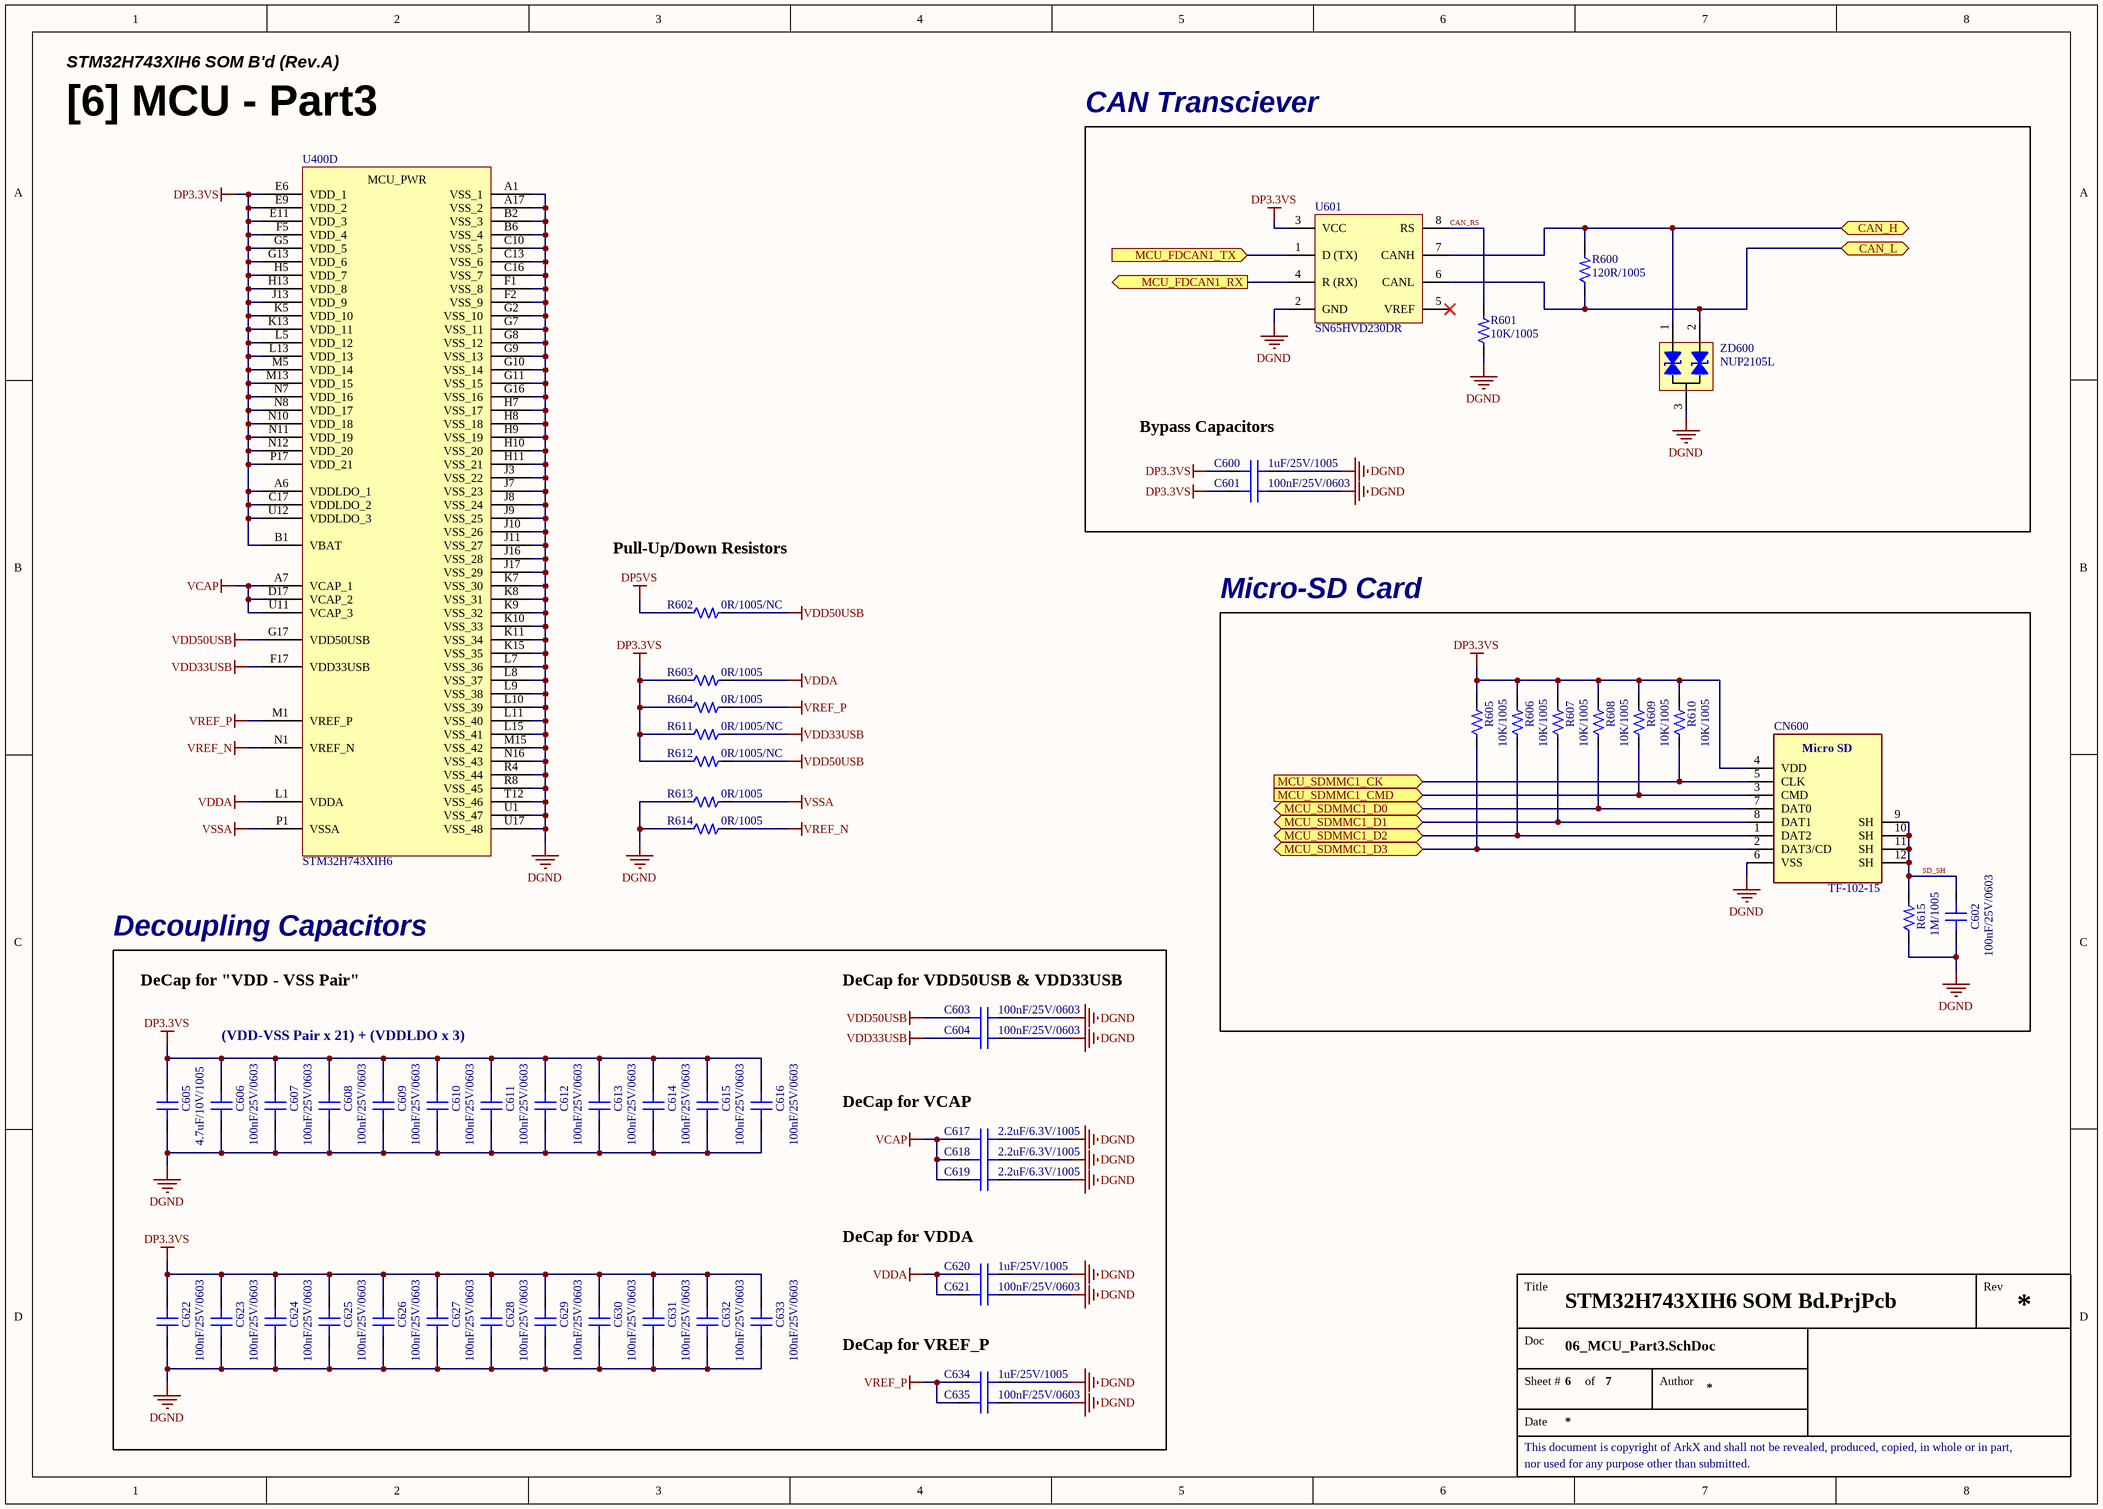
[diagram p5: 06_MCU_Part3.SchDoc]

### Parts
C600  1uF/25V/1005  [CAP 1005 (0402_INCH)]
C601  100nF/25V/0603  [CAP 0603 (0201_INCH)]
C602  100nF/25V/0603  [CAP 0603 (0201_INCH)]
C603  100nF/25V/0603  [CAP 0603 (0201_INCH)]
C604  100nF/25V/0603  [CAP 0603 (0201_INCH)]
C605  4.7uF/10V/1005  [CAP 1005 (0402_INCH)]
C606  100nF/25V/0603  [CAP 0603 (0201_INCH)]
C607  100nF/25V/0603  [CAP 0603 (0201_INCH)]
C608  100nF/25V/0603  [CAP 0603 (0201_INCH)]
C609  100nF/25V/0603  [CAP 0603 (0201_INCH)]
C610  100nF/25V/0603  [CAP 0603 (0201_INCH)]
C611  100nF/25V/0603  [CAP 0603 (0201_INCH)]
C612  100nF/25V/0603  [CAP 0603 (0201_INCH)]
C613  100nF/25V/0603  [CAP 0603 (0201_INCH)]
C614  100nF/25V/0603  [CAP 0603 (0201_INCH)]
C615  100nF/25V/0603  [CAP 0603 (0201_INCH)]
C616  100nF/25V/0603  [CAP 0603 (0201_INCH)]
C617  2.2uF/6.3V/1005  [CAP 1005 (0402_INCH)]
C618  2.2uF/6.3V/1005  [CAP 1005 (0402_INCH)]
C619  2.2uF/6.3V/1005  [CAP 1005 (0402_INCH)]
C620  1uF/25V/1005  [CAP 1005 (0402_INCH)]
C621  100nF/25V/0603  [CAP 0603 (0201_INCH)]
C622  100nF/25V/0603  [CAP 0603 (0201_INCH)]
C623  100nF/25V/0603  [CAP 0603 (0201_INCH)]
C624  100nF/25V/0603  [CAP 0603 (0201_INCH)]
C625  100nF/25V/0603  [CAP 0603 (0201_INCH)]
C626  100nF/25V/0603  [CAP 0603 (0201_INCH)]
C627  100nF/25V/0603  [CAP 0603 (0201_INCH)]
C628  100nF/25V/0603  [CAP 0603 (0201_INCH)]
C629  100nF/25V/0603  [CAP 0603 (0201_INCH)]
C630  100nF/25V/0603  [CAP 0603 (0201_INCH)]
C631  100nF/25V/0603  [CAP 0603 (0201_INCH)]
C632  100nF/25V/0603  [CAP 0603 (0201_INCH)]
C633  100nF/25V/0603  [CAP 0603 (0201_INCH)]
C634  1uF/25V/1005  [CAP 1005 (0402_INCH)]
C635  100nF/25V/0603  [CAP 0603 (0201_INCH)]
CN600  TF-102-15  [CON_MICRO-SD_Socket_TF-102-15]
R600  120R/1005  [RES 1005 (0402_inch)]
R601  10K/1005  [RES 1005 (0402_inch)]
R602  0R/1005/NC  [RES 1005 (0402_inch)/NC]
R603  0R/1005  [RES 1005 (0402_inch)]
R604  0R/1005  [RES 1005 (0402_inch)]
R605  10K/1005  [RES 1005 (0402_inch)]
R606  10K/1005  [RES 1005 (0402_inch)]
R607  10K/1005  [RES 1005 (0402_inch)]
R608  10K/1005  [RES 1005 (0402_inch)]
R609  10K/1005  [RES 1005 (0402_inch)]
R610  10K/1005  [RES 1005 (0402_inch)]
R611  0R/1005/NC  [RES 1005 (0402_inch)/NC]
R612  0R/1005/NC  [RES 1005 (0402_inch)/NC]
R613  0R/1005  [RES 1005 (0402_inch)]
R614  0R/1005  [RES 1005 (0402_inch)]
R615  1M/1005  [RES 1005 (0402_inch)]
U400  STM32H743XIH6  [IC TFBGA-265]  (part D of 4)
U601  SN65HVD230DR  [SOIC-8 R8 (ANALOG DEV)]
ZD600  NUP2105L  [SOT 23-3 (DIODES INCORPORATED)]

### Blocks framed on the sheet
CAN Transciever: C600 C601 R600 R601 U601 ZD600
Micro-SD Card: C602 CN600 R605-R610 R615
Decoupling Capacitors: C603-C635

### Ports
CAN_H (bidir), CAN_L (bidir), MCU_FDCAN1_RX (out), MCU_FDCAN1_TX (in), MCU_SDMMC1_CK (in), MCU_SDMMC1_CMD (in), MCU_SDMMC1_D0 (bidir), MCU_SDMMC1_D1 (bidir), MCU_SDMMC1_D2 (bidir), MCU_SDMMC1_D3 (bidir)

### Nets
DGND: C600.2 C601.1 C602.2 C603.1 C604.1 C605.1 C606.1 C607.1 C608.1 C609.1 C610.1 C611.1 C612.1 C613.1 C614.1 C615.1 C616.1 C617.2 C618.2 C619.2 C620.2 C621.1 C622.1 C623.1 C624.1 C625.1 C626.1 C627.1 C628.1 C629.1 C630.1 C631.1 C632.1 C633.1 C634.2 C635.1 CN600.6(VSS) R601.1 R613.1 R614.1 R615.1 U400.A1(VSS_1) U400.A17(VSS_2) U400.B2(VSS_3) U400.B6(VSS_4) U400.C10(VSS_5) U400.C13(VSS_6) U400.C16(VSS_7) U400.F1(VSS_8) U400.F2(VSS_9) U400.G2(VSS_10) U400.G7(VSS_11) U400.G8(VSS_12) U400.G9(VSS_13) U400.G10(VSS_14) U400.G11(VSS_15) U400.G16(VSS_16) U400.H7(VSS_17) U400.H8(VSS_18) U400.H9(VSS_19) U400.H10(VSS_20) U400.H11(VSS_21) U400.J3(VSS_22) U400.J7(VSS_23) U400.J8(VSS_24) U400.J9(VSS_25) U400.J10(VSS_26) U400.J11(VSS_27) U400.J16(VSS_28) U400.J17(VSS_29) U400.K7(VSS_30) U400.K8(VSS_31) U400.K9(VSS_32) U400.K10(VSS_33) U400.K11(VSS_34) U400.K15(VSS_35) U400.L7(VSS_36) U400.L8(VSS_37) U400.L9(VSS_38) U400.L10(VSS_39) U400.L11(VSS_40) U400.L15(VSS_41) U400.M15(VSS_42) U400.N16(VSS_43) U400.R4(VSS_44) U400.R8(VSS_45) U400.T12(VSS_46) U400.U1(VSS_47) U400.U17(VSS_48) U601.2(GND) ZD600.3(GND)
DP3.3VS: C600.1 C601.2 C605.2 C606.2 C607.2 C608.2 C609.2 C610.2 C611.2 C612.2 C613.2 C614.2 C615.2 C616.2 C622.2 C623.2 C624.2 C625.2 C626.2 C627.2 C628.2 C629.2 C630.2 C631.2 C632.2 C633.2 CN600.4(VDD) R603.1 R604.1 R605.2 R606.2 R607.2 R608.2 R609.2 R610.2 R611.1 R612.1 U400.A6(VDDLDO_1) U400.B1(VBAT) U400.C17(VDDLDO_2) U400.E6(VDD_1) U400.E9(VDD_2) U400.E11(VDD_3) U400.F5(VDD_4) U400.G5(VDD_5) U400.G13(VDD_6) U400.H5(VDD_7) U400.H13(VDD_8) U400.J13(VDD_9) U400.K5(VDD_10) U400.K13(VDD_11) U400.L5(VDD_12) U400.L13(VDD_13) U400.M5(VDD_14) U400.M13(VDD_15) U400.N7(VDD_16) U400.N8(VDD_17) U400.N10(VDD_18) U400.N11(VDD_19) U400.N12(VDD_20) U400.P17(VDD_21) U400.U12(VDDLDO_3) U601.3(VCC)
DP5VS: R602.1
VCAP: C617.1 C618.1 C619.1 U400.A7(VCAP_1) U400.D17(VCAP_2) U400.U11(VCAP_3)
VDD33USB: C604.2 R611.2 U400.F17(VDD33USB)
VDD50USB: C603.2 R602.2 R612.2 U400.G17(VDD50USB)
VDDA: C620.1 C621.2 R603.2 U400.L1(VDDA)
VREF_N: R614.2 U400.N1(VREF_N)
VREF_P: C634.1 C635.2 R604.2 U400.M1(VREF_P)
VSSA: R613.2 U400.P1(VSSA)
CAN_H: R600.2 U601.7(CANH) ZD600.1(CANH) ; port CAN_H
CAN_L: R600.1 U601.6(CANL) ZD600.2(CANL) ; port CAN_L
CAN_RS: R601.2 U601.8(RS)
MCU_FDCAN1_RX: U601.4(R_(RX)) ; port MCU_FDCAN1_RX
MCU_FDCAN1_TX: U601.1(D_(TX)) ; port MCU_FDCAN1_TX
MCU_SDMMC1_CK: CN600.5(CLK) R610.1 ; port MCU_SDMMC1_CK
MCU_SDMMC1_CMD: CN600.3(CMD) R609.1 ; port MCU_SDMMC1_CMD
MCU_SDMMC1_D0: CN600.7(DAT0) R608.1 ; port MCU_SDMMC1_D0
MCU_SDMMC1_D1: CN600.8(DAT1) R607.1 ; port MCU_SDMMC1_D1
MCU_SDMMC1_D2: CN600.1(DAT2) R606.1 ; port MCU_SDMMC1_D2
MCU_SDMMC1_D3: CN600.2(DAT3/CD) R605.1 ; port MCU_SDMMC1_D3
SD_SH: C602.1 CN600.9(SH) CN600.10(SH) CN600.11(SH) CN600.12(SH) R615.2

Not connected (* = marked no-connect by the designer): U601 5(VREF)*

### Notes on the sheet
- STM32H743XIH6 SOM B'd (Rev.A)
- [6] MCU - Part3
- Bypass Capacitors
- Pull-Up/Down Resistors
- DeCap for "VDD - VSS Pair"
- (near C603) DeCap for VDD50USB & VDD33USB
- (VDD-VSS Pair x 21) + (VDDLDO x 3)
- (near C617) DeCap for VCAP
- (near C620) DeCap for VDDA
- DeCap for VREF_P
- Title
- Rev
- Doc
- Sheet #
- of
- Author
- This document is copyright of ArkX and shall not be revealed, produced, copied, in whole or in part,
- Date
- nor used for any purpose other than submitted.
- (in symbol CON_MICRO-SD_Socket_TF-102-15) Micro SD
- (in symbol IC_MCU_STM32H743XIH6, part D) MCU_PWR

### Library data of the parts
C600 C620 C634 = CAP_1uF/25V/1005: Ceramic CAP_1uF/25V/1005; LCSC Part #: C52923; JLCPCB Part Type: Basic Part
C601-C604 C606-C616 C621-C633 C635 = CAP_100nF/25V/0603: Ceramic CAP_100nF/25V/0603; JLCPCB Part Type: Extended Part; LCSC Part #: C181047
C605 = CAP_4.7uF/10V/1005: as C404 on sheet 04_MCU-Part1; JLCPCB Part Type: Basic Part; LCSC Part #: C23733
C617-C619 = CAP_2.2uF/6.3V/1005: Ceramic CAP_2.2uF/6.3V/1005; LCSC Part #: C12530; JLCPCB Part Type: Basic Part
CN600 = CON_MICRO-SD_Socket_TF-102-15: -25℃~+85℃ 1.6mm Gold Deck MicroSD card (TF card) 260℃ Phosphor coppe Clamshell SMD  SD Card Connectors ROHS; LCSC Part #: C266609; JLCPCB Part Type: Extended Part
R600 = RES_120R/1005/62.5mW: Value: 120R; Power Rating: 62.5mW; Precision: 1%; Size: 1005; LCSC Part #: C25079; JLCPCB Part Type: Basic Part
R601 R605-R610 = RES_10K/1005/62.5mW: as R301 on sheet 03_Power; Size: 1005; LCSC Part #: C25744; JLCPCB Part Type: Basic Part
R602 R611 R612 = RES_NC_0R/1005/62.5mW: RES_0R/1005/62.5mW/NC; Value: 0R; Power Rating: 62.5mW; Precision: 1%; Size: 1005
R603 R604 R613 R614 = RES_0R/1005/62.5mW: as R400 on sheet 04_MCU-Part1; Size: 1005; LCSC Part #: C17168; JLCPCB Part Type: Basic Part
R615 = RES_1M/1005/62.5mW: as R502 on sheet 05_MCU-Part2; Size: 1005; LCSC Part #: C26083; JLCPCB Part Type: Basic Part
U400 = IC_MCU_STM32H743XIH6: as U400 on sheet 04_MCU-Part1; LCSC Part #: C114407; JLCPCB Part Type: Extended Part
U601 = IC_CAN_SN65HVD230DR: IC TRANSCEIVER HALF 1/1 8SOIC; LCSC Part #: C12084; JLCPCB Part Type: Basic Part
ZD600 = DIO_TVS_NUP2105L: SOT-23 ESD PROTECTION DEVICES RO; LCSC Part #: C5158054; JLCPCB Part Type: Extended Part

## Sheet 07_Connector.SchDoc
size A3; SheetNumber: 7; SheetTotal: 7
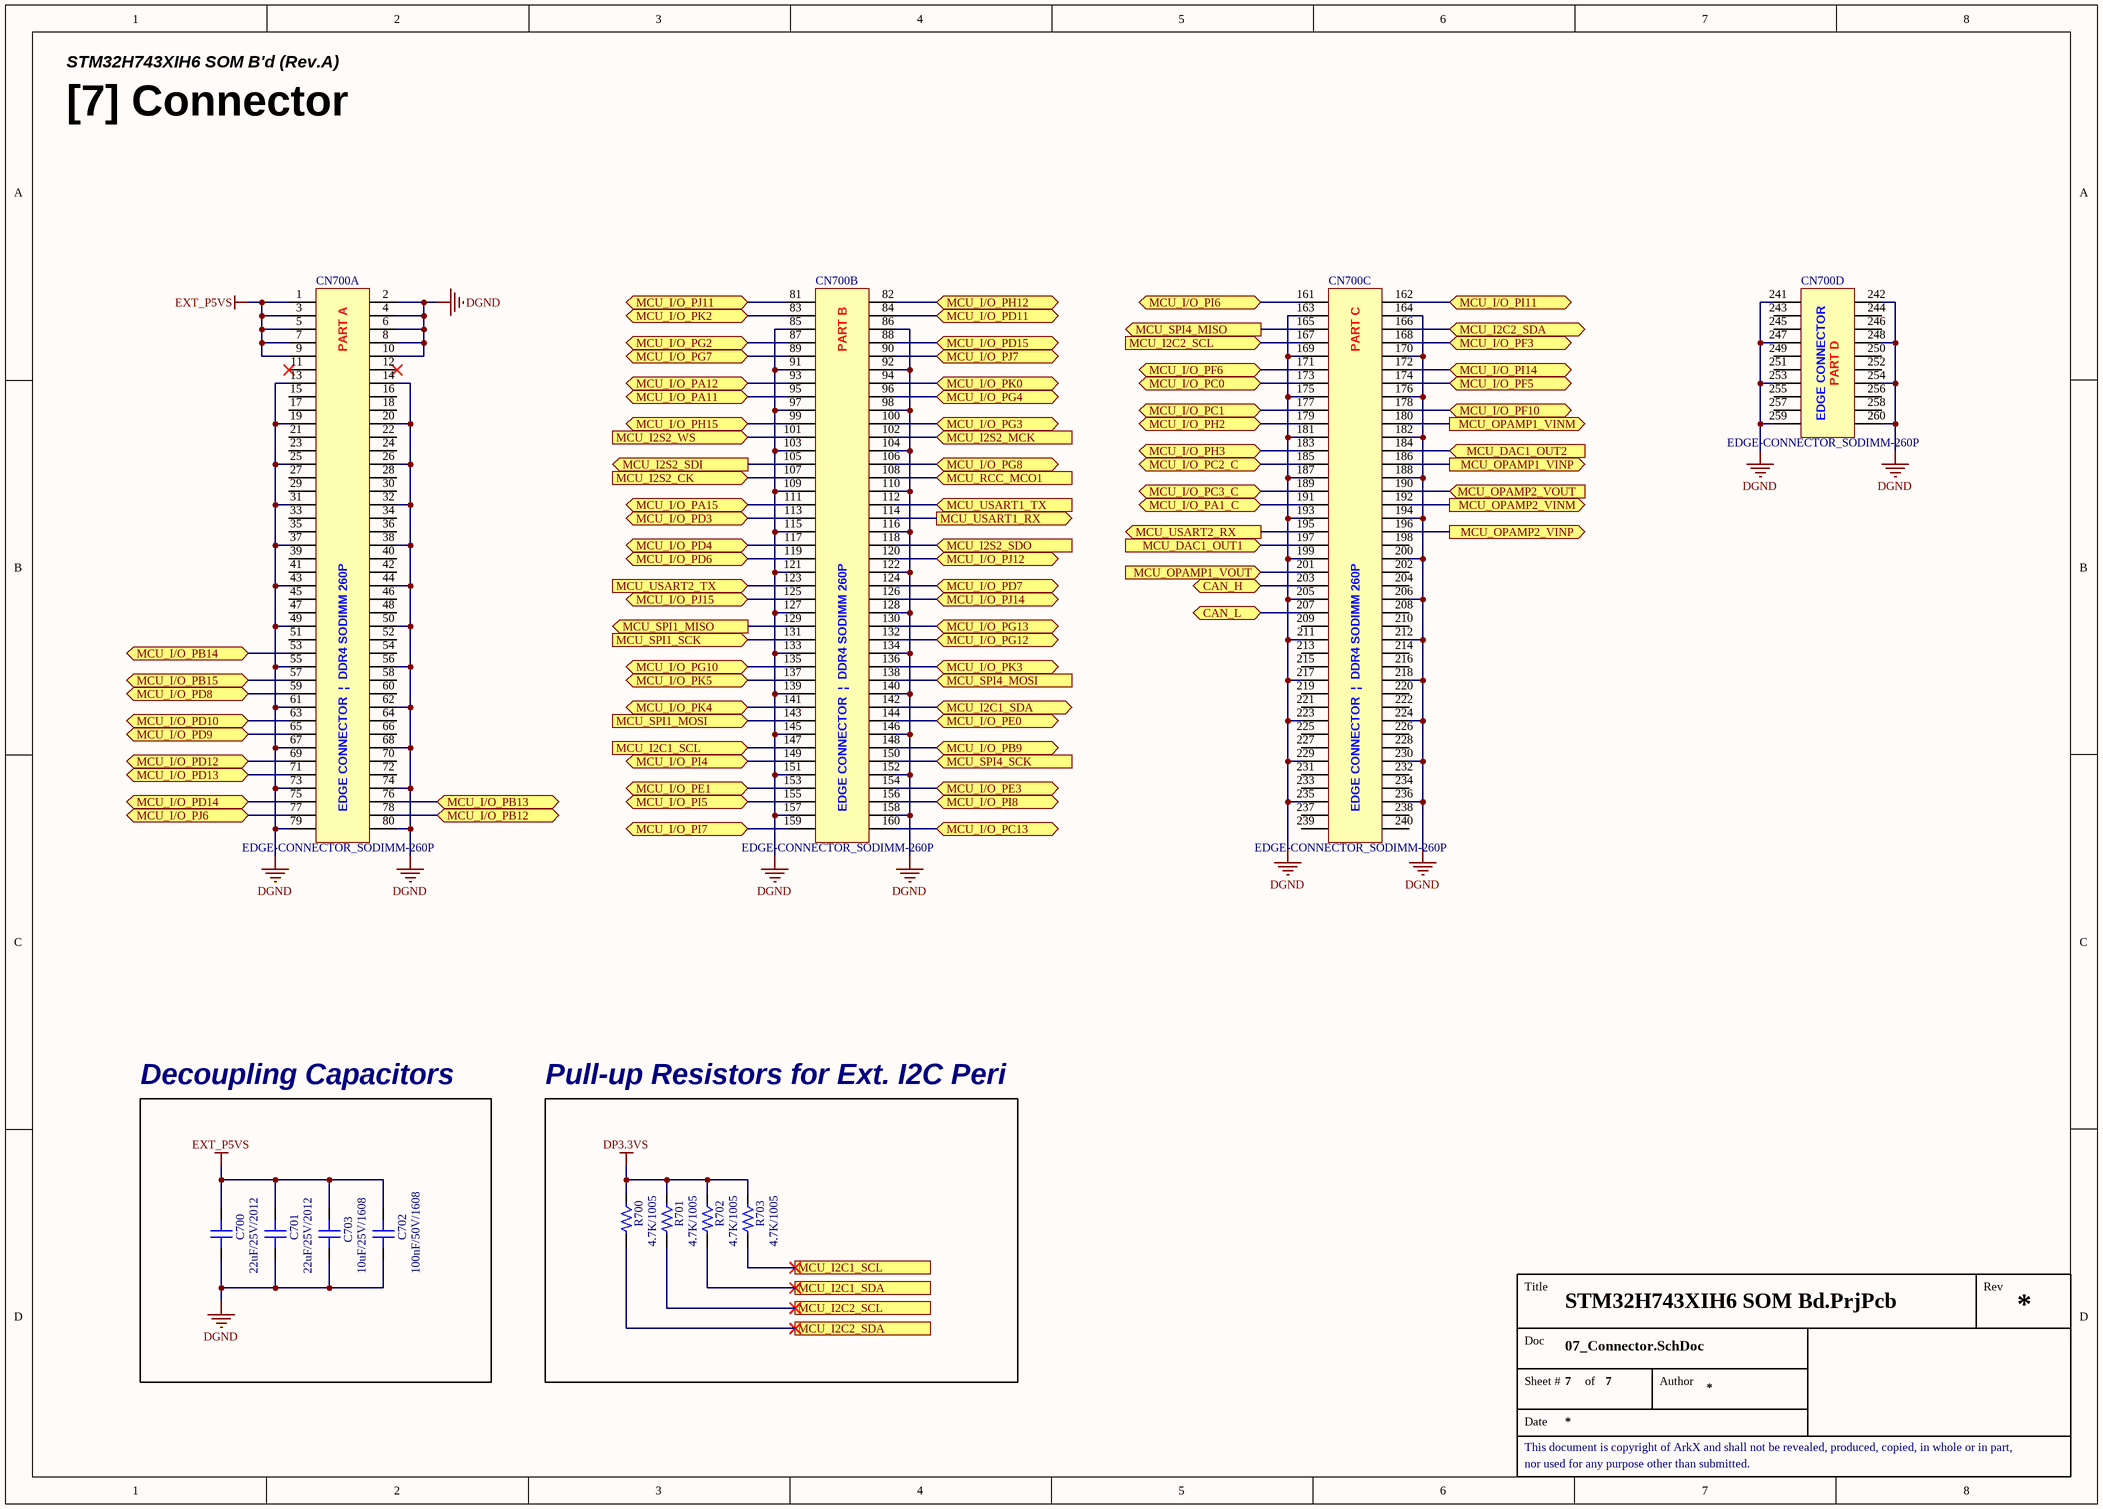
[diagram p6: 07_Connector.SchDoc]

### Parts
C700  22uF/25V/2012  [CAP 2012 (0805_INCH)]
C701  22uF/25V/2012  [CAP 2012 (0805_INCH)]
C702  100nF/50V/1608  [CAP 1608 (0603_INCH)]
C703  10uF/25V/1608  [CAP 1608 (0603_INCH)]
CN700  EDGE-CONNECTOR_SODIMM-260P  [CON_EDGE-CONNECTOR_DDR4-SODIMM-260P]  (parts A,B,C,D of 4)
R700  4.7K/1005  [RES 1005 (0402_inch)]
R701  4.7K/1005  [RES 1005 (0402_inch)]
R702  4.7K/1005  [RES 1005 (0402_inch)]
R703  4.7K/1005  [RES 1005 (0402_inch)]

### Blocks framed on the sheet
Decoupling Capacitors: C700-C703
Pull-up Resistors for Ext. I2C Peri: R700-R703

### Ports
CAN_H (bidir), CAN_L (bidir), MCU_DAC1_OUT1 (in), MCU_DAC1_OUT2 (in), MCU_I2C1_SCL, MCU_I2C1_SCL (in), MCU_I2C1_SDA, MCU_I2C1_SDA (bidir), MCU_I2C2_SCL, MCU_I2C2_SCL (in), MCU_I2C2_SDA, MCU_I2C2_SDA (bidir), MCU_I2S2_CK (in), MCU_I2S2_MCK (in), MCU_I2S2_SDI (out), MCU_I2S2_SDO (in), MCU_I2S2_WS (in), MCU_I/O_PA1_C (bidir), MCU_I/O_PA11 (bidir), MCU_I/O_PA12 (bidir), MCU_I/O_PA15 (bidir), MCU_I/O_PB9 (bidir), MCU_I/O_PB12 (bidir), MCU_I/O_PB13 (bidir), MCU_I/O_PB14 (bidir), MCU_I/O_PB15 (bidir), MCU_I/O_PC0 (bidir), MCU_I/O_PC1 (bidir), MCU_I/O_PC2_C (bidir), MCU_I/O_PC3_C (bidir), MCU_I/O_PC13 (bidir), MCU_I/O_PD3 (bidir), MCU_I/O_PD4 (bidir), MCU_I/O_PD6 (bidir), MCU_I/O_PD7 (bidir), MCU_I/O_PD8 (bidir), MCU_I/O_PD9 (bidir), MCU_I/O_PD10 (bidir), MCU_I/O_PD11 (bidir), MCU_I/O_PD12 (bidir), MCU_I/O_PD13 (bidir), MCU_I/O_PD14 (bidir), MCU_I/O_PD15 (bidir), MCU_I/O_PE0 (bidir), MCU_I/O_PE1 (bidir), MCU_I/O_PE3 (bidir), MCU_I/O_PF3 (bidir), MCU_I/O_PF5 (bidir), MCU_I/O_PF6 (bidir), MCU_I/O_PF10 (bidir), MCU_I/O_PG2 (bidir), MCU_I/O_PG3 (bidir), MCU_I/O_PG4 (bidir), MCU_I/O_PG7 (bidir), MCU_I/O_PG8 (bidir), MCU_I/O_PG10 (bidir), MCU_I/O_PG12 (bidir), MCU_I/O_PG13 (bidir), MCU_I/O_PH2 (bidir), MCU_I/O_PH3 (bidir), MCU_I/O_PH12 (bidir), MCU_I/O_PH15 (bidir), MCU_I/O_PI4 (bidir), MCU_I/O_PI5 (bidir), MCU_I/O_PI6 (bidir), MCU_I/O_PI7 (bidir), MCU_I/O_PI8 (bidir), MCU_I/O_PI11 (bidir), MCU_I/O_PI14 (bidir), MCU_I/O_PJ6 (bidir), MCU_I/O_PJ7 (bidir), MCU_I/O_PJ11 (bidir), MCU_I/O_PJ12 (bidir), MCU_I/O_PJ14 (bidir), MCU_I/O_PJ15 (bidir), MCU_I/O_PK0 (bidir), MCU_I/O_PK2 (bidir), MCU_I/O_PK3 (bidir), MCU_I/O_PK4 (bidir), MCU_I/O_PK5 (bidir), MCU_OPAMP1_VINM (out), MCU_OPAMP1_VINP (out), MCU_OPAMP1_VOUT (in), MCU_OPAMP2_VINM (out), MCU_OPAMP2_VINP (out), MCU_OPAMP2_VOUT (in), MCU_RCC_MCO1 (in), MCU_SPI1_MISO (out), MCU_SPI1_MOSI (in), MCU_SPI1_SCK (in), MCU_SPI4_MISO (out), MCU_SPI4_MOSI (in), MCU_SPI4_SCK (in), MCU_USART1_RX (out), MCU_USART1_TX (in), MCU_USART2_RX (out), MCU_USART2_TX (in)

### Nets
DGND: C700.1 C701.1 C702.1 C703.1 CN700.2 CN700.4 CN700.6 CN700.8 CN700.10 CN700.13 CN700.14 CN700.19 CN700.20 CN700.25 CN700.26 CN700.31 CN700.32 CN700.37 CN700.38 CN700.43 CN700.44 CN700.49 CN700.50 CN700.55 CN700.56 CN700.61 CN700.62 CN700.67 CN700.68 CN700.73 CN700.74 CN700.79 CN700.80 CN700.85 CN700.86 CN700.91 CN700.92 CN700.97 CN700.98 CN700.103 CN700.104 CN700.109 CN700.110 CN700.115 CN700.116 CN700.121 CN700.122 CN700.127 CN700.128 CN700.133 CN700.134 CN700.139 CN700.140 CN700.145 CN700.146 CN700.151 CN700.152 CN700.157 CN700.158 CN700.163 CN700.164 CN700.169 CN700.170 CN700.175 CN700.176 CN700.181 CN700.182 CN700.187 CN700.188 CN700.193 CN700.194 CN700.199 CN700.200 CN700.205 CN700.206 CN700.211 CN700.212 CN700.217 CN700.218 CN700.223 CN700.224 CN700.229 CN700.230 CN700.235 CN700.236 CN700.241 CN700.242 CN700.247 CN700.248 CN700.253 CN700.254 CN700.259 CN700.260
DP3.3VS: R700.1 R701.1 R702.1 R703.1
EXT_P5VS: C700.2 C701.2 C702.2 C703.2 CN700.1 CN700.3 CN700.5 CN700.7 CN700.9
CAN_H: CN700.203 ; port CAN_H
CAN_L: CN700.207 ; port CAN_L
MCU_DAC1_OUT1: CN700.197 ; port MCU_DAC1_OUT1
MCU_DAC1_OUT2: CN700.184 ; port MCU_DAC1_OUT2
MCU_I2C1_SCL: CN700.147 R703.2 ; port MCU_I2C1_SCL
MCU_I2C1_SDA: CN700.142 R702.2 ; port MCU_I2C1_SDA
MCU_I2C2_SCL: CN700.167 R701.2 ; port MCU_I2C2_SCL
MCU_I2C2_SDA: CN700.166 R700.2 ; port MCU_I2C2_SDA
MCU_I2S2_CK: CN700.107 ; port MCU_I2S2_CK
MCU_I2S2_MCK: CN700.102 ; port MCU_I2S2_MCK
MCU_I2S2_SDI: CN700.105 ; port MCU_I2S2_SDI
MCU_I2S2_SDO: CN700.118 ; port MCU_I2S2_SDO
MCU_I2S2_WS: CN700.101 ; port MCU_I2S2_WS
MCU_I/O_PA1_C: CN700.191 ; port MCU_I/O_PA1_C
MCU_I/O_PA11: CN700.95 ; port MCU_I/O_PA11
MCU_I/O_PA12: CN700.93 ; port MCU_I/O_PA12
MCU_I/O_PA15: CN700.111 ; port MCU_I/O_PA15
MCU_I/O_PB9: CN700.148 ; port MCU_I/O_PB9
MCU_I/O_PB12: CN700.78 ; port MCU_I/O_PB12
MCU_I/O_PB13: CN700.76 ; port MCU_I/O_PB13
MCU_I/O_PB14: CN700.53 ; port MCU_I/O_PB14
MCU_I/O_PB15: CN700.57 ; port MCU_I/O_PB15
MCU_I/O_PC0: CN700.173 ; port MCU_I/O_PC0
MCU_I/O_PC1: CN700.177 ; port MCU_I/O_PC1
MCU_I/O_PC2_C: CN700.185 ; port MCU_I/O_PC2_C
MCU_I/O_PC3_C: CN700.189 ; port MCU_I/O_PC3_C
MCU_I/O_PC13: CN700.160 ; port MCU_I/O_PC13
MCU_I/O_PD3: CN700.113 ; port MCU_I/O_PD3
MCU_I/O_PD4: CN700.117 ; port MCU_I/O_PD4
MCU_I/O_PD6: CN700.119 ; port MCU_I/O_PD6
MCU_I/O_PD7: CN700.124 ; port MCU_I/O_PD7
MCU_I/O_PD8: CN700.59 ; port MCU_I/O_PD8
MCU_I/O_PD9: CN700.65 ; port MCU_I/O_PD9
MCU_I/O_PD10: CN700.63 ; port MCU_I/O_PD10
MCU_I/O_PD11: CN700.84 ; port MCU_I/O_PD11
MCU_I/O_PD12: CN700.69 ; port MCU_I/O_PD12
MCU_I/O_PD13: CN700.71 ; port MCU_I/O_PD13
MCU_I/O_PD14: CN700.75 ; port MCU_I/O_PD14
MCU_I/O_PD15: CN700.88 ; port MCU_I/O_PD15
MCU_I/O_PE0: CN700.144 ; port MCU_I/O_PE0
MCU_I/O_PE1: CN700.153 ; port MCU_I/O_PE1
MCU_I/O_PE3: CN700.154 ; port MCU_I/O_PE3
MCU_I/O_PF3: CN700.168 ; port MCU_I/O_PF3
MCU_I/O_PF5: CN700.174 ; port MCU_I/O_PF5
MCU_I/O_PF6: CN700.171 ; port MCU_I/O_PF6
MCU_I/O_PF10: CN700.178 ; port MCU_I/O_PF10
MCU_I/O_PG2: CN700.87 ; port MCU_I/O_PG2
MCU_I/O_PG3: CN700.100 ; port MCU_I/O_PG3
MCU_I/O_PG4: CN700.96 ; port MCU_I/O_PG4
MCU_I/O_PG7: CN700.89 ; port MCU_I/O_PG7
MCU_I/O_PG8: CN700.106 ; port MCU_I/O_PG8
MCU_I/O_PG10: CN700.135 ; port MCU_I/O_PG10
MCU_I/O_PG12: CN700.132 ; port MCU_I/O_PG12
MCU_I/O_PG13: CN700.130 ; port MCU_I/O_PG13
MCU_I/O_PH2: CN700.179 ; port MCU_I/O_PH2
MCU_I/O_PH3: CN700.183 ; port MCU_I/O_PH3
MCU_I/O_PH12: CN700.82 ; port MCU_I/O_PH12
MCU_I/O_PH15: CN700.99 ; port MCU_I/O_PH15
MCU_I/O_PI4: CN700.149 ; port MCU_I/O_PI4
MCU_I/O_PI5: CN700.155 ; port MCU_I/O_PI5
MCU_I/O_PI6: CN700.161 ; port MCU_I/O_PI6
MCU_I/O_PI7: CN700.159 ; port MCU_I/O_PI7
MCU_I/O_PI8: CN700.156 ; port MCU_I/O_PI8
MCU_I/O_PI11: CN700.162 ; port MCU_I/O_PI11
MCU_I/O_PI14: CN700.172 ; port MCU_I/O_PI14
MCU_I/O_PJ6: CN700.77 ; port MCU_I/O_PJ6
MCU_I/O_PJ7: CN700.90 ; port MCU_I/O_PJ7
MCU_I/O_PJ11: CN700.81 ; port MCU_I/O_PJ11
MCU_I/O_PJ12: CN700.120 ; port MCU_I/O_PJ12
MCU_I/O_PJ14: CN700.126 ; port MCU_I/O_PJ14
MCU_I/O_PJ15: CN700.125 ; port MCU_I/O_PJ15
MCU_I/O_PK0: CN700.94 ; port MCU_I/O_PK0
MCU_I/O_PK2: CN700.83 ; port MCU_I/O_PK2
MCU_I/O_PK3: CN700.136 ; port MCU_I/O_PK3
MCU_I/O_PK4: CN700.141 ; port MCU_I/O_PK4
MCU_I/O_PK5: CN700.137 ; port MCU_I/O_PK5
MCU_OPAMP1_VINM: CN700.180 ; port MCU_OPAMP1_VINM
MCU_OPAMP1_VINP: CN700.186 ; port MCU_OPAMP1_VINP
MCU_OPAMP1_VOUT: CN700.201 ; port MCU_OPAMP1_VOUT
MCU_OPAMP2_VINM: CN700.192 ; port MCU_OPAMP2_VINM
MCU_OPAMP2_VINP: CN700.196 ; port MCU_OPAMP2_VINP
MCU_OPAMP2_VOUT: CN700.190 ; port MCU_OPAMP2_VOUT
MCU_RCC_MCO1: CN700.108 ; port MCU_RCC_MCO1
MCU_SPI1_MISO: CN700.129 ; port MCU_SPI1_MISO
MCU_SPI1_MOSI: CN700.143 ; port MCU_SPI1_MOSI
MCU_SPI1_SCK: CN700.131 ; port MCU_SPI1_SCK
MCU_SPI4_MISO: CN700.165 ; port MCU_SPI4_MISO
MCU_SPI4_MOSI: CN700.138 ; port MCU_SPI4_MOSI
MCU_SPI4_SCK: CN700.150 ; port MCU_SPI4_SCK
MCU_USART1_RX: CN700.114 ; port MCU_USART1_RX
MCU_USART1_TX: CN700.112 ; port MCU_USART1_TX
MCU_USART2_RX: CN700.195 ; port MCU_USART2_RX
MCU_USART2_TX: CN700.123 ; port MCU_USART2_TX

Not connected (* = marked no-connect by the designer): CN700 11* 12* 15 16 17 18 21 22 23 24 27 28 29 30 33 34 35 36 39 40 41 42 45 46 47 48 51 52 54 58 60 64 66 70 72 198 202 204 208 209 210 213 214 215 216 219 220 221 222 225 226 227 228 231 232 233 234 237 238 239 240 243 244 245 246 249 250 251 252 255 256 257 258

### Notes on the sheet
- STM32H743XIH6 SOM B'd (Rev.A)
- [7] Connector
- Title
- Rev
- Doc
- Sheet #
- of
- Author
- This document is copyright of ArkX and shall not be revealed, produced, copied, in whole or in part,
- Date
- nor used for any purpose other than submitted.
- (in symbol CON_EDGE-CONNECTOR_DDR4-SODIMM-260P, part A) PART A; EDGE CONNECTOR  |  DDR4 SODIMM 260P
- (in symbol CON_EDGE-CONNECTOR_DDR4-SODIMM-260P, part B) PART B; EDGE CONNECTOR  |  DDR4 SODIMM 260P
- (in symbol CON_EDGE-CONNECTOR_DDR4-SODIMM-260P, part C) PART C; EDGE CONNECTOR  |  DDR4 SODIMM 260P
- (in symbol CON_EDGE-CONNECTOR_DDR4-SODIMM-260P, part D) EDGE CONNECTOR; PART D

### Library data of the parts
C700 C701 = CAP_22uF/25V/2012: Ceramic CAP_22uF/25V/2012; LCSC Part #: C45783; JLCPCB Part Type: Basic Part
C702 = CAP_100nF/50V/1608: Ceramic CAP_100nF/50V/1608; LCSC Part #: C14663; JLCPCB Part Type: Basic Part
C703 = CAP_10uF/25V/1608: Ceramic CAP_10uF/25V/1608; LCSC Part #: C96446; JLCPCB Part Type: Basic Part
CN700 = CON_EDGE-CONNECTOR_DDR4-SODIMM-260P: EDGE-CONNECTOR_DDR4-SODIMM-260P; Mating Part Number: 2309409-1
R700-R703 = RES_4.7K/1005/62.5mW: as R302 on sheet 03_Power; Size: 1005; LCSC Part #: C25900; JLCPCB Part Type: Basic Part